# EAGLE board MJ838 - rev.1c (EAGLE 9.6.2)
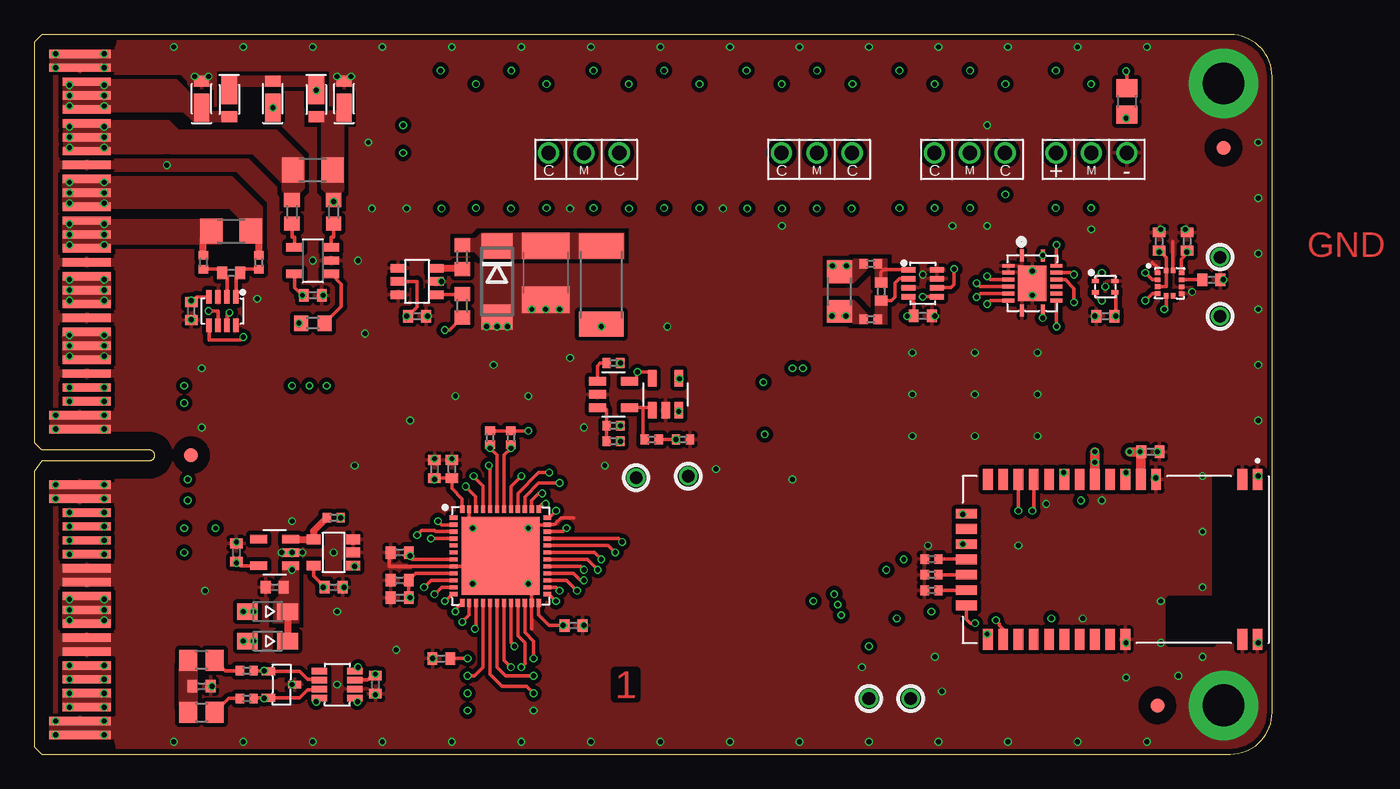
[diagram p23: board, top side]
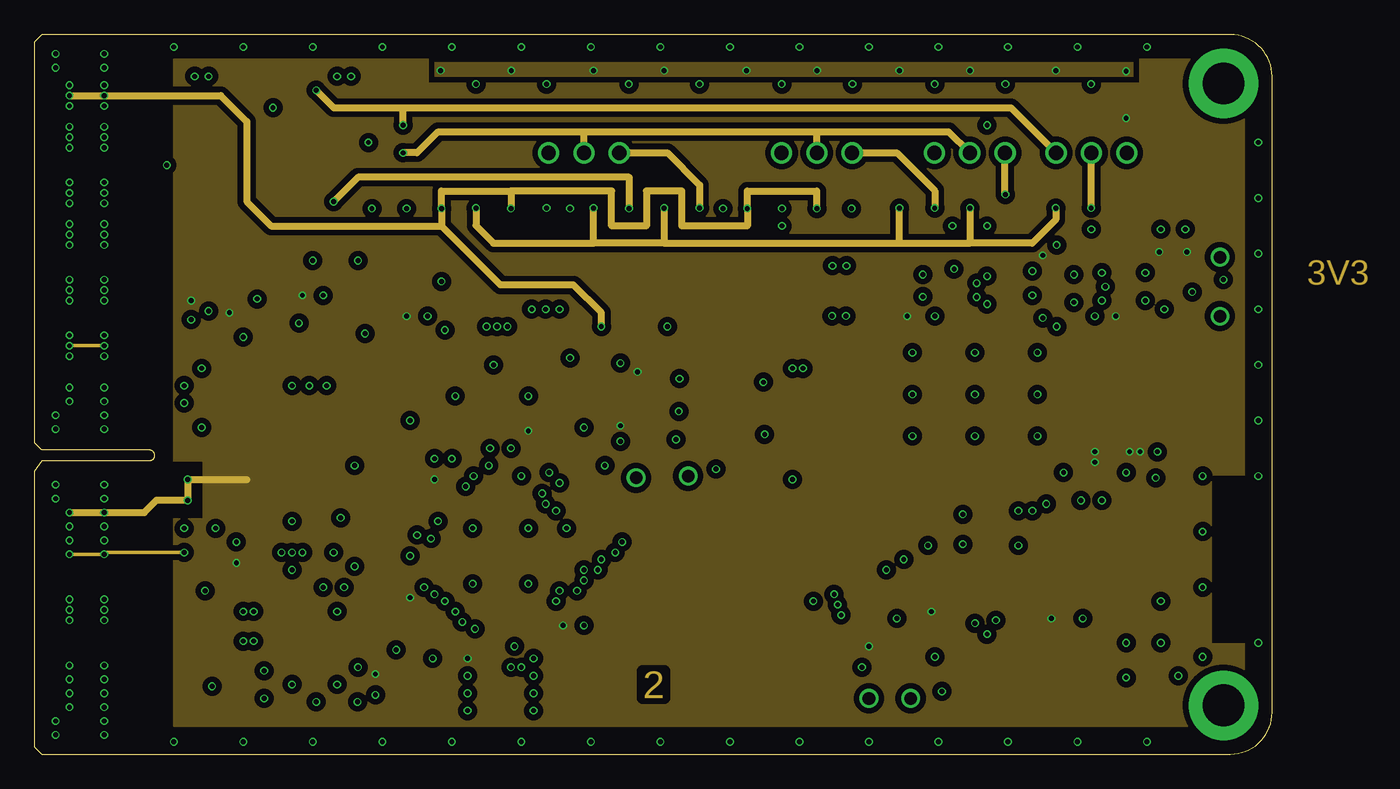
[diagram p24: board, inner layer Route2]
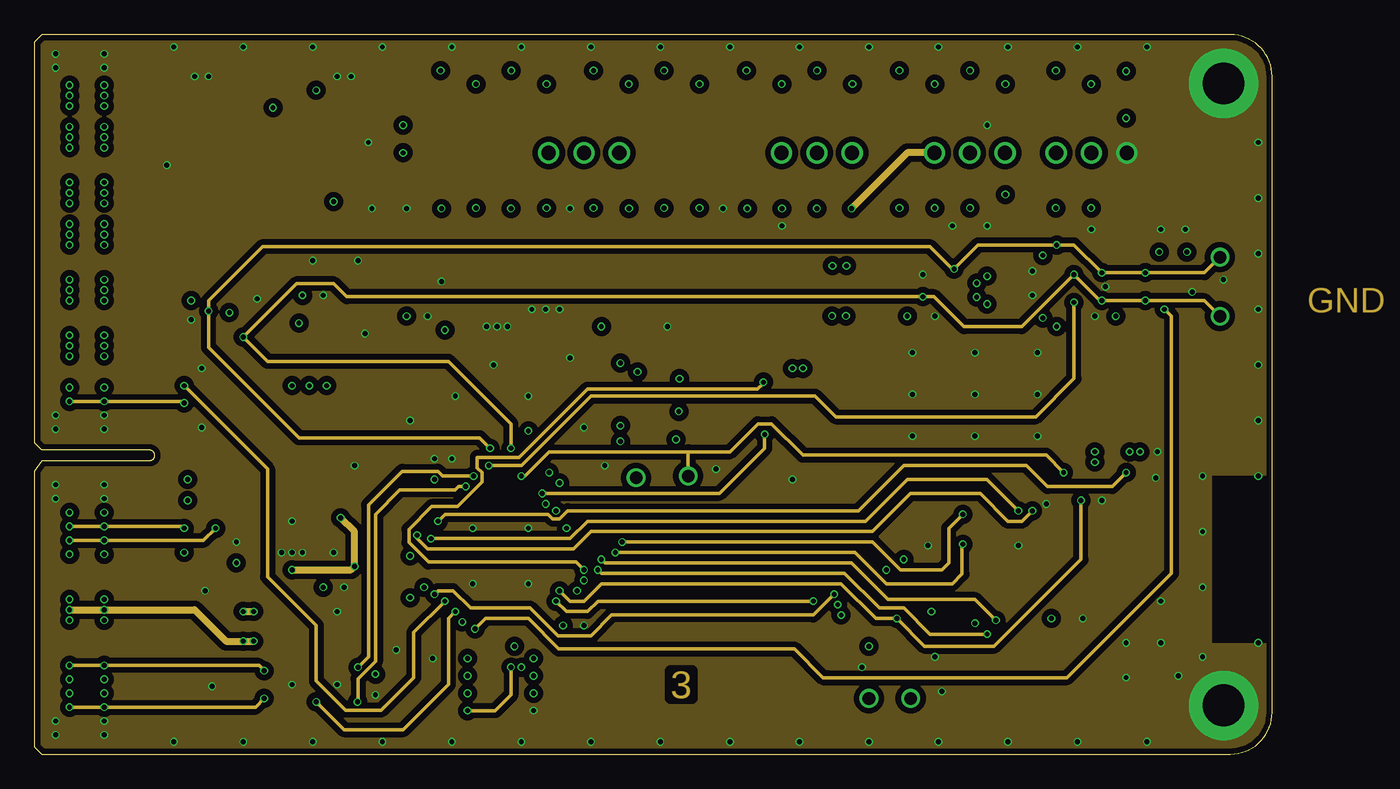
[diagram p25: board, inner layer Route3]
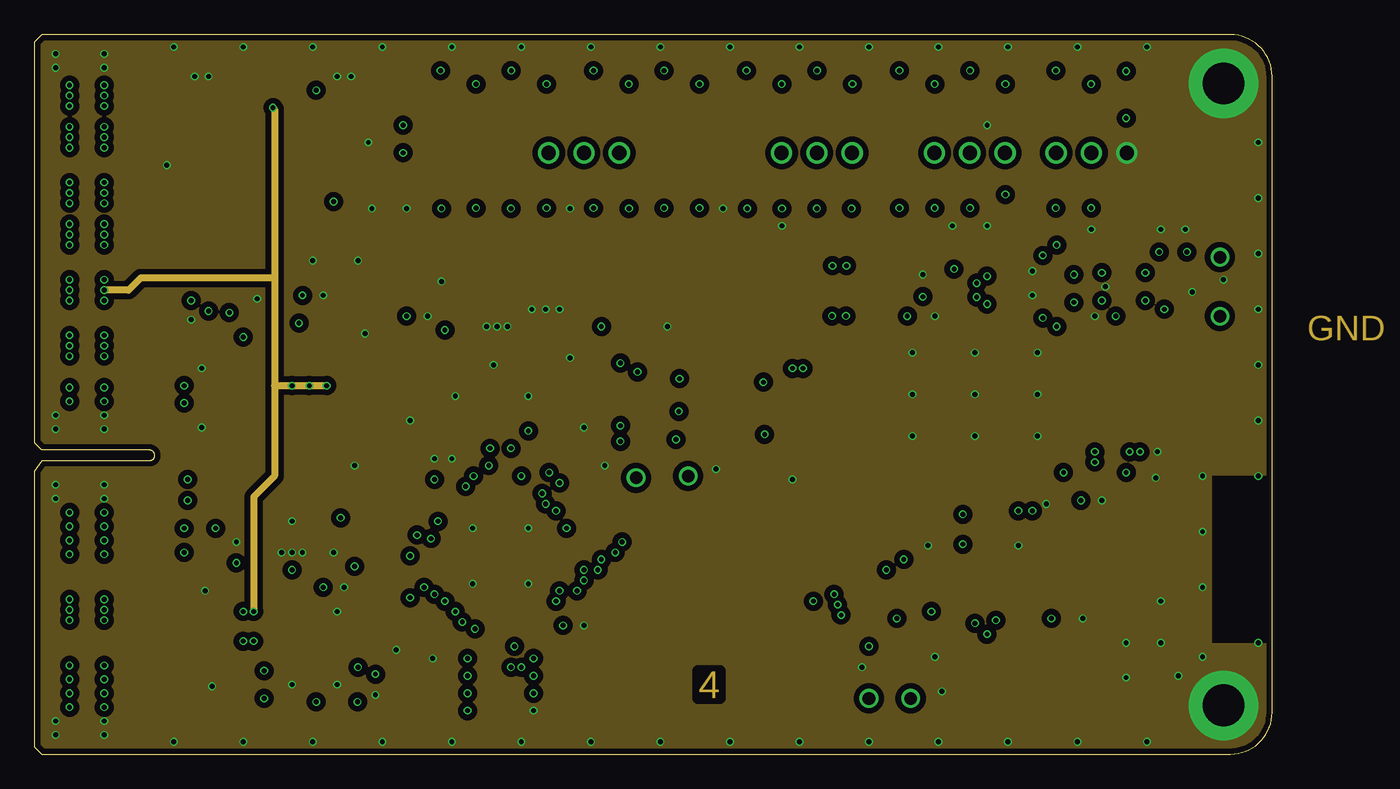
[diagram p26: board, inner layer Route14]
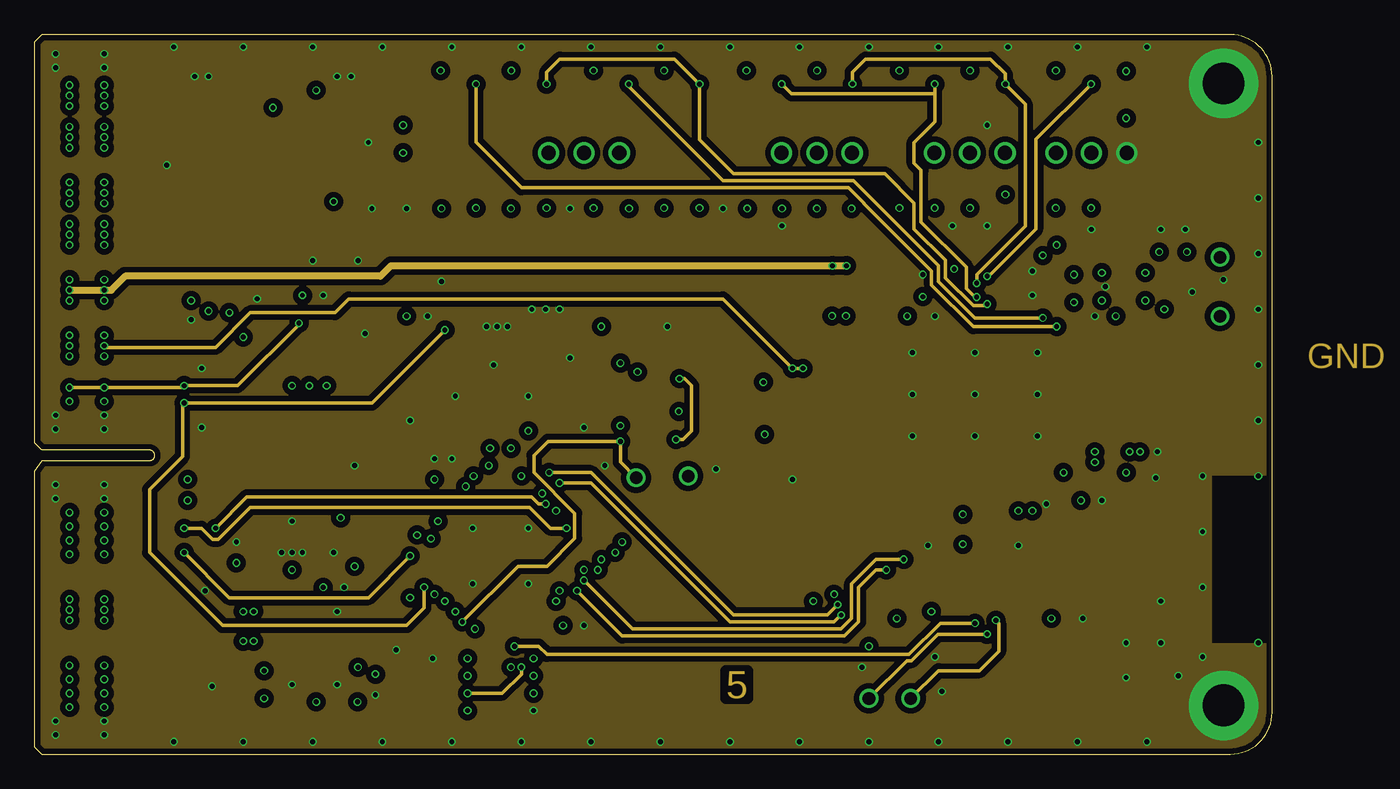
[diagram p27: board, inner layer Route15]
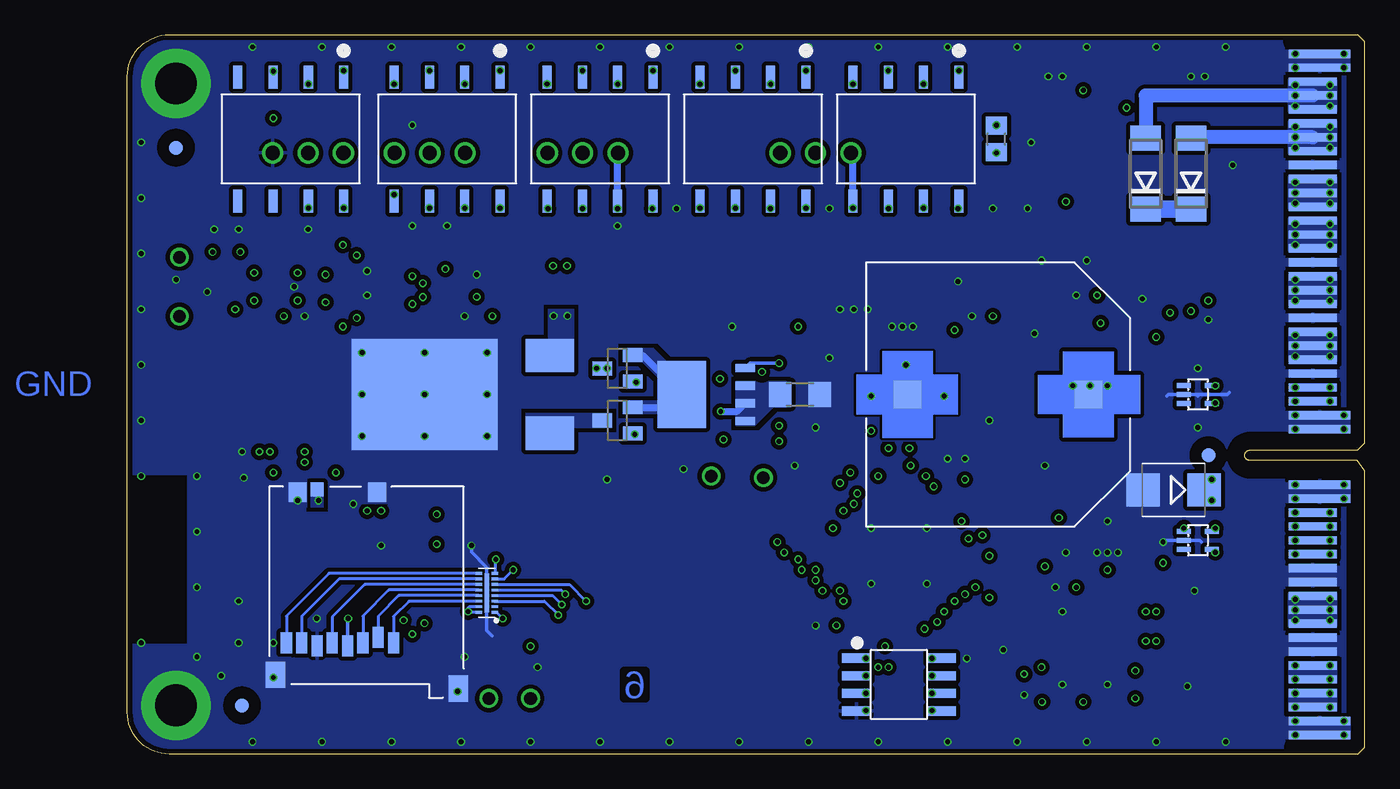
[diagram p28: board, bottom side, seen from below]

Size 89 x 51.75 mm. Coordinates in mm from the lower left corner, seen from the top.
Outline: 0.5,0 0,0.5 0,20.38 0.55,21.12 8.3,21.12 arc90 8.62,21.48 arc90 8.25,21.88 0.5,21.88 0,22.38 0,51.25 0.5,51.75 86,51.75 arc-90 89,48.75 89,3 arc-90 86,0 0.5,0
Copper layers (1*2*3*14*15*16): Top 0.0432mm / dielectric 0.1107mm / Route2 0.0175mm / dielectric 4mil / Route3 0.0175mm / dielectric 0.925575mm / Route14 0.0175mm / dielectric 4mil / Route15 0.0175mm / dielectric 0.1107mm / Bottom 0.0432mm
Design rules "oshpark-6layer": minimum track width 5mil, minimum drill 8mil, track to track 5mil, track to pad 5mil, pad to pad 5mil, via to via 5mil, smd to smd 5mil, copper to edge 15mil, drill to drill 6mil, minimum pad ring 4mil, minimum via ring 4mil, stop-mask expansion 1.5mil, vias tented up to drill 0mil, thermal gap 10mil
Net classes: 0 GND: width 0.25 mm, drill 0.35 mm, clearance 0.19 mm; 1 BAT+: width 0.5 mm, drill 0.35 mm, clearance 0.5 mm to class 0, clearance 0.5 mm; 2 signal: width 0.25 mm, drill 0.35 mm, clearance 0.19 mm to class 0, clearance 0.19 mm to class 1, clearance 0.19 mm; 3 3V3: width 0.25 mm, drill 0.35 mm, clearance 0.19 mm to class 0, clearance 0.19 mm to class 1, clearance 0.19 mm to class 2, clearance 0.19 mm; 4 Vdc: width 0.5 mm, drill 0.35 mm, clearance 0.5 mm to class 0, clearance 0.5 mm to class 1, clearance 0.5 mm to class 2, clearance 0.5 mm to class 3, clearance 0.5 mm; 5 Vdynamo: width 0.5 mm, drill 0.35 mm, clearance 0.5 mm to class 0, clearance 0.5 mm to class 1, clearance 0.5 mm to class 2, clearance 0.5 mm to class 3, clearance 0.5 mm to class 4, clearance 0.5 mm; 6 Vac: width 0.5 mm, drill 0.35 mm, clearance 0.5 mm to class 0, clearance 0.5 mm to class 1, clearance 0.5 mm to class 2, clearance 0.5 mm to class 3, clearance 0.5 mm to class 4, clearance 0.5 mm to class 5, clearance 0.5 mm

## Footprints (pad centres in the part's own frame; a part is rotated, then mirrored left to right if it is on the bottom)
C0402 = smd 0.7 x 0.9: 1 -0.65,0; 2 0.65,0
LGA-12 = smd 0.39 x 0.33: 1_SCLK -0.863,0.755; 2_MOSI/SDA -0.863,0.255; 3_MISO/ASEL -0.863,-0.245; 4_!CS!/SCL -0.863,-0.745; 7_GND 0.858,-0.757; 8_ADC_IN 0.858,-0.258; 9_VREG_OUT 0.858,0.242; 10_VS 0.858,0.743 | smd 0.33 x 0.39: 5_INT1 -0.25,-0.912; 6_INT2 0.25,-0.912; 11_GND 0.25,0.91; 12_VDDIO -0.25,0.91
SOT-23-5 = smd 0.6 x 1.2: 1 0.95,1.15; 2 0,1.15; 3 -0.95,1.15; 4 -0.95,-1.15; 5 0.95,-1.15
SOT669 = smd 4.826 x 3.5: D 0,1.755 | smd 0.6 x 1.4: G 1.9,-2.8; S1 -1.91,-2.8; S2 -0.64,-2.8; S3 0.63,-2.8
SOT-23-8 = smd 1 x 0.4: P$1 -1.025,0.975; P$2 -1.025,0.325; P$3 -1.025,-0.325; P$4 -1.025,-0.975; P$5 1.025,-0.975; P$6 1.025,-0.325; P$7 1.025,0.325; P$8 1.025,0.975
R0402 = smd 0.6 x 0.7: 1 -0.5,0; 2 0.5,0
R1206 = smd 1.6 x 1.803: 1 -1.422,0; 2 1.422,0
SOT23 = smd 1 x 1.4: 1 -0.95,-1.1; 2 0.95,-1.1; 3 0,1.1
TO-263-2 = smd 2.4 x 3.5: 1 -2.8,1.75; 2 2.8,1.75 | smd 8 x 10.52: DIE 0,10.75
MODULE_RN4678-V/RM100 = smd 1.5 x 0.7: 1 -5.75,10.2; 2 -5.75,9.1; 3 -5.75,2.9; 4 -5.75,1.8; 5 -5.75,0.7; 6 -5.75,-0.4; 7 -5.75,-1.5; 8 -5.75,-2.6; 9 -5.75,-3.7; 10 -5.75,-4.8; 11 -5.75,-5.9; 12 -5.75,-7; 13 -5.75,-8.1; 14 -5.75,-9.2; 22 5.75,-9.2; 23 5.75,-8.1; 24 5.75,-7; 25 5.75,-5.9; 26 5.75,-4.8; 27 5.75,-3.7; 28 5.75,-2.6; 29 5.75,-1.5; 30 5.75,-0.4; 31 5.75,0.7; 32 5.75,9.1; 33 5.75,10.2 | smd 0.7 x 1.5: 15 -3.3,-10.75; 16 -2.2,-10.75; 17 -1.1,-10.75; 18 0,-10.75; 19 1.1,-10.75; 20 2.2,-10.75; 21 3.3,-10.75
SOT23-8 = smd 0.45 x 1.1: P$1 -0.975,-1.275; P$2 -0.325,-1.275; P$3 0.325,-1.275; P$4 0.975,-1.275; P$5 0.975,1.275; P$6 0.325,1.275; P$7 -0.325,1.275; P$8 -0.975,1.275
SOT-23-3 = smd 0.56 x 0.95: 1 -0.95,-0.95; 2 0.95,-0.95; 3 0,0.95
R0805 = smd 1.3 x 1.5: 1 -0.95,0; 2 0.95,0
SMD = smd 4.45 x 0.6: 1 0,24.5; 3 0,23.5; 35 0,7.5; 37 0,6.5; 45 0,2.5; 47 0,1.5; 97 0,-23.5; 99 0,-24.5 | smd 4.45 x 0.6 bottom: 2 0,24.5; 4 0,23.5; 36 0,7.5; 38 0,6.5; 46 0,2.5; 48 0,1.5; 98 0,-23.5; 100 0,-24.5 | smd 3.45 x 0.6: 5 0.5,22.5; 7 0.5,21.5; 9 0.5,20.5; 11 0.5,19.5; 13 0.5,18.5; 15 0.5,17.5; 17 0.5,16.5; 19 0.5,15.5; 21 0.5,14.5; 23 0.5,13.5; 25 0.5,12.5; 27 0.5,11.5; 29 0.5,10.5; 31 0.5,9.5; 33 0.5,8.5; 49 0.5,0.5; 51 0.5,-0.5; 53 0.5,-1.5; 55 0.5,-2.5; 57 0.5,-3.5; 59 0.5,-4.5; 61 0.5,-5.5; 63 0.5,-6.5; 65 0.5,-7.5; 67 0.5,-8.5; 69 0.5,-9.5; 71 0.5,-10.5; 73 0.5,-11.5; 75 0.5,-12.5; 77 0.5,-13.5; 79 0.5,-14.5; 81 0.5,-15.5; 83 0.5,-16.5; 85 0.5,-17.5; 87 0.5,-18.5; 89 0.5,-19.5; 91 0.5,-20.5; 93 0.5,-21.5; 95 0.5,-22.5 | smd 3.45 x 0.6 bottom: 6 0.5,22.5; 8 0.5,21.5; 10 0.5,20.5; 12 0.5,19.5; 14 0.5,18.5; 16 0.5,17.5; 18 0.5,16.5; 20 0.5,15.5; 22 0.5,14.5; 24 0.5,13.5; 26 0.5,12.5; 28 0.5,11.5; 30 0.5,10.5; 32 0.5,9.5; 34 0.5,8.5; 50 0.5,0.5; 52 0.5,-0.5; 54 0.5,-1.5; 56 0.5,-2.5; 58 0.5,-3.5; 60 0.5,-4.5; 62 0.5,-5.5; 64 0.5,-6.5; 66 0.5,-7.5; 68 0.5,-8.5; 70 0.5,-9.5; 72 0.5,-10.5; 74 0.5,-11.5; 76 0.5,-12.5; 78 0.5,-13.5; 80 0.5,-14.5; 82 0.5,-15.5; 84 0.5,-16.5; 86 0.5,-17.5; 88 0.5,-18.5; 90 0.5,-19.5; 92 0.5,-20.5; 94 0.5,-21.5; 96 0.5,-22.5
SMB = smd 2.4 x 2.4: A 2.2,0; C -2.2,0
FIDUCIAL_1MM = smd 1 x 1: 1 0,0
SMD' = smd 0.5 x 0.3: SCL -0.7,-0.4; SDA -0.7,0.4; VDD 0.7,-0.4; VSS 0.7,0.4
SOT323-5 = smd 1 x 0.35: GND -1,0; I1 -1,0.65; I2 -1,-0.65; I3 1,-0.65; I4 1,0.65
SOIC08 = smd 2.032 x 0.66: 1 -3.073,1.905; 2 -3.073,0.635; 3 -3.073,-0.635; 4 -3.073,-1.905; 5 3.073,-1.905; 6 3.073,-0.635; 7 3.073,0.635; 8 3.073,1.905
SOT23-5 = smd 0.7 x 1: 1_VDD -0.95,-1.4; 2_GND 0,-1.4; 3_GND 0.95,-1.4; 4_DOUT 0.95,1.45; 5_CD -0.95,1.45
SOT-23-5L = smd 0.6 x 1.2: ADJ/NC -0.95,-1.15; EN -0.95,1.15; GND 0,1.15; IN 0.95,1.15; OUT 0.95,-1.15
SOD323-W = smd 1.5 x 1.2: A 1.45,0; C -1.45,0
DO214AA = smd 1.8 x 2.2: A 2.55,0; C -2.55,0
US2H = smd 2 x 1.1: A -1,0 | smd 0.8 x 1.1: C 0.9,0
TH-2S = drill 1.016: 1_POS -2.54,0; 2_MID 0,0; 3_NEG 2.54,0
SMD_DIP8 = smd 0.65 x 1.65: 1_ANODE1 -3.81,-4.44; 2_CATHODE1 -1.27,-4.44; 3_ANODE2 1.27,-4.44; 4_CATHODE2 3.81,-4.44; 5_DRAIN2-1 3.81,4.48; 6_DRAIN2-2 1.27,4.48; 7_DRAIN1-1 -1.27,4.48; 8_DRAIN1-2 -3.81,4.48
VQFN16 = smd 0.85 x 0.28: 1 -1.975,-0.75; 8 1.975,-0.75; 9 1.975,0.75; 16 -1.975,0.75 | smd 0.28 x 0.85: 2 -1.25,-1.725; 3 -0.75,-1.725; 4 -0.25,-1.725; 5 0.25,-1.725; 6 0.75,-1.725; 7 1.25,-1.725; 10 1.25,1.725; 11 0.75,1.725; 12 0.25,1.725; 13 -0.25,1.725; 14 -0.75,1.725; 15 -1.25,1.725 | smd 2.55 x 2.05: 17 0,0
TH-2S-BACK-TO-BACK = drill 1.016: 1_C -2.54,0; 2_MID 0,0; 3_C 2.54,0
SOT23-5' = smd 0.6 x 1.2: 1 -0.95,-1.306; 2 0,-1.306; 3 0.95,-1.306; 4 0.95,1.306; 5 -0.95,1.306
R0603 = smd 1 x 1.1: 1 -0.85,0; 2 0.85,0
CAP_EEEFK1E472SV = smd 2 x 2: + -6.5,0; - 6.5,0
C1812 = smd 1.9 x 3.4: 1 -1.95,0; 2 1.95,0
SOT-23 = smd 1.1 x 0.6: P$1 -1.35,0.95; P$2 -1.35,0; P$3 -1.35,-0.95; P$4 1.35,-0.95; P$5 1.35,0; P$6 1.35,0.95
R2512 = smd 1.8 x 3.2: 1 -2.8,0; 2 2.8,0
SMD'' = smd 0.95 x 1: CARD_DETECT -3.56,7.4 | smd 0.8 x 1.5: CD/DATA3 0.84,-3.26; CLK -2.46,-3.66; CMD -0.26,-3.66; DATA0 -4.66,-3.66; DATA1 -5.76,-3.66; DATA2 1.94,-3.66; GND -3.56,-3.86; VDD -1.36,-3.86 | smd 1.3 x 1.4: S1 -4.95,7.2; S2 0.75,7.2 | smd 1.4 x 1.9: S3 -6.55,-5.95; S4 6.6,-6.95
MICRO_QFN = smd 0.2 x 0.45: 1 -1.4,-0.375; 2 -1,-0.375; 3 -0.6,-0.375; 4 -0.2,-0.375; 5 0.2,-0.375; 6 0.6,-0.375; 7 1,-0.375; 8 1.4,-0.375; 9 1.4,0.775; 10 1,0.775; 11 0.6,0.775; 12 0.2,0.775; 13 -0.2,0.775; 14 -0.6,0.775; 15 -1,0.775; 16 -1.4,0.775 | smd 2.8 x 0.3: 17 0,0.2
UFQFPN48 = smd 0.55 x 0.3: P$1 -3.375,2.75; P$2 -3.375,2.25; P$3 -3.375,1.75; P$4 -3.375,1.25; P$5 -3.375,0.75; P$6 -3.375,0.25; P$7 -3.375,-0.25; P$8 -3.375,-0.75; P$9 -3.375,-1.25; P$10 -3.375,-1.75; P$11 -3.375,-2.25; P$12 -3.375,-2.75; P$25 3.375,-2.75; P$26 3.375,-2.25; P$27 3.375,-1.75; P$28 3.375,-1.25; P$29 3.375,-0.75; P$30 3.375,-0.25; P$31 3.375,0.25; P$32 3.375,0.75; P$33 3.375,1.25; P$34 3.375,1.75; P$35 3.375,2.25; P$36 3.375,2.75 | smd 0.3 x 0.55: P$13 -2.75,-3.375; P$14 -2.25,-3.375; P$15 -1.75,-3.375; P$16 -1.25,-3.375; P$17 -0.75,-3.375; P$18 -0.25,-3.375; P$19 0.25,-3.375; P$20 0.75,-3.375; P$21 1.25,-3.375; P$22 1.75,-3.375; P$23 2.25,-3.375; P$24 2.75,-3.375; P$37 2.75,3.375; P$38 2.25,3.375; P$39 1.75,3.375; P$40 1.25,3.375; P$41 0.75,3.375; P$42 0.25,3.375; P$43 -0.25,3.375; P$44 -0.75,3.375; P$45 -1.25,3.375; P$46 -1.75,3.375; P$47 -2.25,3.375; P$48 -2.75,3.375 | smd 5.6 x 5.6: PAD 0,0
TH-0.9 = drill 0.9: P$1 0,0

## Placement (x,y rotation side)
ACCELEROMETER:C1  0.1uF / 10V  [C0402]  80.88,36.88 270 top
ACCELEROMETER:C2  0.2uF / 10V  [C0402]  84.62,34.12 180 top
ACCELEROMETER:C4  0.11uF / 10V  [C0402]  82.88,36.88 270 top
ACCELEROMETER:IC1  ADXL367BCCZ-RL7  [LGA-12]  81.62,33.88 0 top
ADJUSTABLE_LOAD:IC2  AD8515ARTZ-REEL7  [SOT-23-5]  41.62,25.88 90 top
ADJUSTABLE_LOAD:IC3  PH2925U,115  [SOT669]  47.38,25.88 90 bottom
ADJUSTABLE_LOAD:IC4  AD8515ARTZ-REEL7  [SOT-23-5]  45.38,25.88 180 top
ADJUSTABLE_LOAD:INA219:C1  0.1uF / 10V  [C0402]  63.88,31.52 0 top
ADJUSTABLE_LOAD:INA219:C2  ???  [C0402]  60.88,33.27 270 top
ADJUSTABLE_LOAD:INA219:IC3  INA219BIDCNT  [SOT-23-8]  63.88,33.87 0 top
ADJUSTABLE_LOAD:INA219:R3  ???  [R0402]  60.12,31.27 180 top
ADJUSTABLE_LOAD:INA219:R4  0.1R / 0.5W - LVK12R100CER  [R1206]  57.88,33.27 270 top
ADJUSTABLE_LOAD:INA219:R5  ???  [R0402]  60.12,35.27 180 top
ADJUSTABLE_LOAD:Q2  BSS123  [SOT23]  53.75,24 90 bottom
ADJUSTABLE_LOAD:Q3  BSS123  [SOT23]  53.75,27.75 90 bottom
ADJUSTABLE_LOAD:R1  3k  [R0402]  46.62,22.62 180 top
ADJUSTABLE_LOAD:R2  0.1R / 0.5W - LVK12R100CER  [R1206]  40.62,25.88 180 bottom
ADJUSTABLE_LOAD:R3  1k  [R0402]  41.62,28.12 0 top
ADJUSTABLE_LOAD:R4  27k  [R0402]  44.38,22.62 180 top
ADJUSTABLE_LOAD:R5  12R, 20W, AP725 12R F  [TO-263-2]  56.88,25.88 90 bottom
ADJUSTABLE_LOAD:R6  100k  [R0402]  41.62,23.62 0 top
ADJUSTABLE_LOAD:R7  10k  [R0402]  41.62,22.5 180 top
BLUETOOTH:C1  10uF / 10V  [C0402]  80.25,21.75 180 top
BLUETOOTH:IC1  RN4678-V/RM113  [MODULE_RN4678-V/RM100]  77.75,14 270 top
BLUETOOTH:R1  0R  [R0402]  64.5,14.03 180 top
BLUETOOTH:R2  0R  [R0402]  64.5,12.9 180 top
BLUETOOTH:R3  0R  [R0402]  64.5,11.78 180 top
CAN_INFRA:C1  47nF / 10V  [C0402]  12,4.88 0 top
CAN_INFRA:C5  0.1uF / 10V  [C0402]  24.5,5 270 top
CAN_INFRA:IC1  TCAN334GDCNT  [SOT23-8]  21.75,5 90 top
CAN_INFRA:IC2  SZNUP2105LT1G  [SOT-23-3]  17.75,5 270 top
CAN_INFRA:R1  60R, 0.5W  [R0805]  12,6.75 180 top
CAN_INFRA:R2  60R, 0.5W  [R0805]  12,3 0 top
CAN_INFRA:R3  0  [R0402]  15.25,4 0 top
CAN_INFRA:R4  0  [R0402]  15.25,6 0 top
CONN1  MEC1-150-02-F-D-RA1-SL  [SMD]  3.25,25.88 180 bottom
D1  SMLVT3V3  [SMB]  13.75,19 180 bottom
FID1  n/a  [FIDUCIAL_1MM]  80.75,3.5 0 bottom
FID2  n/a  [FIDUCIAL_1MM]  11.25,21.5 180 top
FID3  n/a  [FIDUCIAL_1MM]  11.25,21.5 0 bottom
FID4  n/a  [FIDUCIAL_1MM]  80.75,3.5 180 top
FID5  n/a  [FIDUCIAL_1MM]  85.5,43.62 0 bottom
FID6  n/a  [FIDUCIAL_1MM]  85.5,43.62 180 top
HUMIDITY_SENSOR:C5  0.1uF / 10V  [C0402]  77,31.5 180 top
HUMIDITY_SENSOR:IC1  SHT40-AD1F-R2  [SMD']  77,33.62 0 top
IC1  ESDALC6V1W5  [SOT323-5]  12,25.88 0 bottom
IC2  ESDALC6V1W5  [SOT323-5]  12,15.38 0 bottom
INA1:C1  0.1uF / 10V  [C0402]  11.26,31.87 270 top
INA1:C2  ???  [C0402]  14.12,34.62 180 top
INA1:IC3  INA219BIDCNT  [SOT-23-8]  13.51,31.87 270 top
INA1:R3  ???  [R0402]  12.12,35.38 90 top
INA1:R4  0.1R / 0.5W - LVK12R100CER  [R1206]  14.12,37.62 180 top
INA1:R5  ???  [R0402]  16.12,35.38 90 top
M-RAM:C2  0.1uF / 10V  [C0402]  29.25,6.88 0 top
M-RAM:IC1  S3A3204V0M-AI1AT  [SOIC08]  33.5,5 0 bottom
MARKER1  6 layer  [6L]  41.5,5 0 top
RECTIFIER:3V3:C1  1uF / 10V  [C0402]  21.5,12 0 top
RECTIFIER:3V3:C2  1uF / 10V  [C0402]  17.25,12 180 top
RECTIFIER:3V3:C7  1uF / 10V  [C0402]  14.5,14.5 270 top
RECTIFIER:3V3:IC1  R3119N058A  [SOT23-5]  21.5,14.5 90 top
RECTIFIER:3V3:IC2  LDK320AM33R  [SOT-23-5L]  17.25,14.5 270 top
RECTIFIER:3V3:R1  100k / 0.1W  [R0402]  21.5,17 180 top
RECTIFIER:D1  BAT 60A E6327  [SOD323-W]  16.75,8.12 180 top
RECTIFIER:D2  BAT 60A E6327  [SOD323-W]  16.75,10.25 180 top
RECTIFIER:DYNAMO_OVP:D3  19V/5W  [DO214AA]  12.5,41.75 90 bottom
RECTIFIER:DYNAMO_OVP:D4  19V/5W  [DO214AA]  15.75,41.75 90 bottom
RECTIFIER:GRAETZ+DELON:D1  CUHS20S30,H3F  [US2H]  14,46.75 270 top
RECTIFIER:GRAETZ+DELON:D2  CUHS20S30,H3F  [US2H]  12,47.5 90 top
RECTIFIER:GRAETZ+DELON:D3  CUHS20S30,H3F  [US2H]  20.25,46.75 270 top
RECTIFIER:GRAETZ+DELON:D4  CUHS20S30,H3F  [US2H]  22.25,47.5 90 top
RECTIFIER:GRAETZ+DELON:DELON:C1  330μF / 35V / ultralow ESR  [TH-2S]  76,43.25 0 top
RECTIFIER:GRAETZ+DELON:DELON:SSR_NO/NO3:IC1  LAA710S  [SMD_DIP8]  77.25,44.25 180 bottom
RECTIFIER:GRAETZ+DELON:IC1  TLC59208FIRGYR  [VQFN16]  71.75,33.88 270 top
RECTIFIER:GRAETZ+DELON:R1  625  [R0805]  78.55,46.95 270 top
RECTIFIER:GRAETZ+DELON:TUNING_CAPS:C2  1500μF / 35V / ultralow ESR  [TH-2S-BACK-TO-BACK]  39.5,43.25 0 top
RECTIFIER:GRAETZ+DELON:TUNING_CAPS:C3  1500μF / 35V / ultralow ESR  [TH-2S-BACK-TO-BACK]  56.25,43.25 0 top
RECTIFIER:GRAETZ+DELON:TUNING_CAPS:C4  1500μF / 35V / ultralow ESR  [TH-2S-BACK-TO-BACK]  67.25,43.25 0 top
RECTIFIER:GRAETZ+DELON:TUNING_CAPS:R2  47k  [R0805]  26.5,44.25 90 bottom
RECTIFIER:GRAETZ+DELON:TUNING_CAPS:SSR_NO/NO1:IC1  LAA710S  [SMD_DIP8]  55,44.25 180 bottom
RECTIFIER:GRAETZ+DELON:TUNING_CAPS:SSR_NO/NO2:IC1  LAA710S  [SMD_DIP8]  66,44.25 180 bottom
RECTIFIER:GRAETZ+DELON:TUNING_CAPS:SSR_NO/NO3:IC1  LAA710S  [SMD_DIP8]  33,44.25 180 bottom
RECTIFIER:GRAETZ+DELON:TUNING_CAPS:SSR_NO/NO4:IC1  LAA710S  [SMD_DIP8]  44,44.25 180 bottom
RECTIFIER:PHASE_SHIFT:C1  0.1uF / 10V  [C0402]  20,33 180 top
RECTIFIER:PHASE_SHIFT:IC1  LT1716CS5#TRMPBF  [SOT23-5']  20,35.5 90 top
RECTIFIER:PHASE_SHIFT:R1  0R  [R0603]  20,31 180 top
RECTIFIER:PHASE_SHIFT:R2  0R  [R0603]  21.5,39 270 top
RECTIFIER:PHASE_SHIFT:R3  0R  [R0603]  18.5,39 270 top
RECTIFIER:PHASE_SHIFT:R4  0.01R / 0.5W / 0.25%  [R1206]  20,42 0 top
RECTIFIER:SMOOTHING_CAP:C1  EEE-FK1E472SV  [CAP_EEEFK1E472SV]  26.38,25.88 180 bottom
RECTIFIER:SMOOTHING_CAP:D8  CUHS20S30,H3F  [US2H]  17.12,47.5 90 top
RECTIFIER:ZERO-CROSS_DETECTOR:C3  0.1uF / 10V  [C0402]  27.5,31.5 180 top
RECTIFIER:ZERO-CROSS_DETECTOR:C8  10nF / 100v  [C1812]  36.75,34.62 90 top
RECTIFIER:ZERO-CROSS_DETECTOR:D1  6V/3W  [DO214AA]  33.25,34 270 top
RECTIFIER:ZERO-CROSS_DETECTOR:IC1  TLV6703DDCR  [SOT-23]  27.5,34 180 top
RECTIFIER:ZERO-CROSS_DETECTOR:R1  10k/3W  [R2512]  40.75,33.75 90 top
RECTIFIER:ZERO-CROSS_DETECTOR:R2  0R  [R0603]  30.75,35.75 270 top
RECTIFIER:ZERO-CROSS_DETECTOR:R3  0R  [R0603]  30.75,32.25 270 top
SD_CARD:IC1  0473521001  [SMD'']  71.8,11.65 0 bottom
SD_CARD:IC3  EMIF06-MSD02N16  [MICRO_QFN]  62.95,11.6 90 bottom
STM32L4:C1  0.1uF / 10V  [C0402]  38.75,9.25 180 top
STM32L4:C2  0.1uF / 10V  [C0402]  28.75,20.5 270 top
STM32L4:C3  4.7uF / 10V  [C0402]  30,20.5 270 top
STM32L4:C4  0.1uF / 10V  [C0402]  26.25,14.5 0 top
STM32L4:C6  1uF / 10V  [C0402]  26.25,11.25 0 top
STM32L4:C8  0.1uF / 10V  [C0402]  26.25,12.5 0 top
STM32L4:IC1  STM32L4P5CGU6  [UFQFPN48]  33.5,14.25 0 top
STM32L4:R1  1k  [R0402]  32.75,22.75 90 top
STM32L4:R2  1k  [R0402]  34.25,22.75 90 top
TP1  CAN high  [TH-0.9]  85.25,31.5 0 top
TP2  CAN high  [TH-0.9]  85.25,35.75 0 top
TP3  CAN high  [TH-0.9]  63,4 0 top
TP4  CAN high  [TH-0.9]  60,4 0 top
TP5  CAN high  [TH-0.9]  47,20 0 top
TP6  CAN high  [TH-0.9]  43.25,19.88 0 top

## Tracks (layer width: path | path; a pad name or v marks a point on that pad's centre or on a via)
3V3  (via drill 0.35)
  Top 0.25: CAN_INFRA:IC1.P$3 23.93,5.33 24.25,5.65 CAN_INFRA:C5.1 v24.5,5.75 | INA1:IC3.P$4 11.63,32.9 INA1:C1.1 v11.26,32.62 | RECTIFIER:PHASE_SHIFT:IC1.5 18.69,33.56 v19.25,33 RECTIFIER:PHASE_SHIFT:C1.2 | v26.75,31.5 RECTIFIER:ZERO-CROSS_DETECTOR:C3.2 27.5,32.15 27.5,34 RECTIFIER:ZERO-CROSS_DETECTOR:IC1.P$5 | ACCELEROMETER:IC1.10_VS 82.48,35.62 82.98,36.12 ACCELEROMETER:C4.2 v82.88,36.12 | ACCELEROMETER:IC1.3_MISO/ASEL 81.38,33.62 ACCELEROMETER:IC1.12_VDDIO 81.38,35.73 ACCELEROMETER:C1.2 v80.88,36.12 | v62.75,31.5 62.77,31.52 ADJUSTABLE_LOAD:INA219:C1.1 63.23,32.52 ADJUSTABLE_LOAD:INA219:IC3.P$4 | RECTIFIER:GRAETZ+DELON:IC1.16 v72.5,35.88 | BLUETOOTH:C1.2 79.55,21.75 v79.5,21.75 | INA1:IC3.P$7 13.83,31.58 v14,31.75 | STM32L4:IC1.P$48 30.75,18.35 30,19.1 STM32L4:C3.2 STM32L4:C2.2 v28.75,19.75 | STM32L4:R1.2 STM32L4:R2.2 v35.5,23.25 | STM32L4:C1.2 v38,9.25 37,9.25 36.25,10 STM32L4:IC1.P$24 | HUMIDITY_SENSOR:C5.1 v77.75,31.5 77.75,33.17 HUMIDITY_SENSOR:IC1.VDD | RECTIFIER:3V3:IC2.OUT 14.8,13.55 RECTIFIER:3V3:C7.2 v14.5,13.75 | STM32L4:IC1.P$9 27.4,13 STM32L4:C8.2 STM32L4:C6.2 v27,11.25 | ADJUSTABLE_LOAD:IC4.5 44.42,27.5 v43.35,27.5 43.27,27.5 43.27,26.75 42.85,26.75 ADJUSTABLE_LOAD:IC2.5 | M-RAM:C2.2 v31.12,6.88 | v78.5,45.75 78.55,45.8 RECTIFIER:GRAETZ+DELON:R1.2
  Top 0.7: BLUETOOTH:IC1.4 79.55,21.75 79.5,21.8 v79.5,21.75 v78.75,21.75 | BLUETOOTH:IC1.7 v76.25,21.75
  Route2 0.5: v2.5,17.38 v5,17.38 7.88,17.38 8.75,18.25 v11,18.25 v11,19.75 15.25,19.75
  Bottom 0.2: SD_CARD:IC3.15 64.4,10.6 64.5,10.5 v64.5,10.25 64.45,10.2 SD_CARD:IC3.16
  Bottom 0.25: SD_CARD:IC1.VDD 73.16,9.71 v73.12,9.75 | D1.C 11,19.55 v11,19.75 | M-RAM:IC1.8 31.09,6.91 v31.12,6.88
  other vias: 60,7.75 42.12,23.62 76.25,21
  pour Route2 (isolate 0.406, rank 6, no thermals): 10,2 87,2 87,50 10,50
  pour Top: 2.12,17.62 5.38,17.62 5.38,17.12 2.12,17.12
  pour Bottom: 2.12,17.62 5.38,17.62 5.38,17.12 2.12,17.12
  cutout Route2: 10,21 12,21 12,17 10,17
!LED_RST!  (via drill 0.35)
  Top 0.25: RECTIFIER:GRAETZ+DELON:IC1.13 74.12,34.12 74.75,33.5 v74.75,32.5 | v32.66,20.75 32.75,20.66 STM32L4:IC1.P$44
  Route3 0.25: v32.66,20.75 35,20.75 40,25.75 56.12,25.75 57.62,24.25 72,24.25 74.75,27 v74.75,32.5
!QSPI_CS!  (via drill 0.35)
  Top 0.25: STM32L4:IC1.P$22 35.25,8.75 35.88,8.12 v35.88,6.88
  Bottom 0.25: M-RAM:IC1.1 35.91,6.91 v35.88,6.88
!RN4678_SWBTN!  (via drill 0.35)
  Top 0.25: STM32L4:IC1.P$2 29.25,16.5 v29,16.75 | BLUETOOTH:IC1.5 78.45,20.2 v78.5,20.25
  Route3 0.25: v29,16.75 29.5,17.25 36.91,17.25 37.26,16.91 37.74,16.91 38.34,17.5 59.25,17.5 62.5,20.75 71.34,20.75 72.84,19.25 77.5,19.25 v78.5,20.25
!STBY!  (via drill 0.35)
  Top 0.25: CAN_INFRA:IC1.P$8 20.25,3.8 v20.25,3.75 | STM32L4:IC1.P$13 30.25,10.38 v30.25,10.25
  Route3 0.25: v20.25,3.75 22.25,1.75 26.5,1.75 29.75,5 29.75,9.75 v30.25,10.25
ACCELEROMETER:VREG
  Top 0.25: ACCELEROMETER:IC1.9_VREG_OUT ACCELEROMETER:C2.2
ADJL  (via drill 0.35)
  Top 0.25: v36.5,18.75 36.25,18.75 35.75,18.25 STM32L4:IC1.P$38
  Route3 0.25: v36.5,18.75 49.25,18.75 52.5,22 v52.5,23
  Bottom 0.25: ADJUSTABLE_LOAD:Q2.1 52.55,23.05 v52.5,23
ADJUSTABLE_LOAD:DRAIN
  Bottom 0.5: ADJUSTABLE_LOAD:Q3.2 51.95,28.7 ADJUSTABLE_LOAD:IC3.D 50.05,24.95 ADJUSTABLE_LOAD:Q2.2
  pour Bottom (no thermals): 53.35,28.2 53.35,29.2 51.2,29.2 49,27 49,26.25 50,26.25 51.95,28.2
  pour Bottom (no thermals): 53.35,24.45 53.35,25.45 50.5,25.45 50.5,24.45
ADJUSTABLE_LOAD:GATE_COMMON  (via drill 0.35)
  Bottom 0.25: ADJUSTABLE_LOAD:R3.2 44.23,28.12 ADJUSTABLE_LOAD:IC3.G
  other vias: 42.12,28.12
ADJUSTABLE_LOAD:GATE_COMMON-DRIVER_OUT
  Top 0.25: ADJUSTABLE_LOAD:R3.1 40.67,28.12 40.48,27.93 ADJUSTABLE_LOAD:IC2.1
ADJUSTABLE_LOAD:IN+
  Top 0.25: ADJUSTABLE_LOAD:R7.2 ADJUSTABLE_LOAD:R6.1 41.12,24.77 40.98,24.93 ADJUSTABLE_LOAD:IC2.3
ADJUSTABLE_LOAD:IN-  (via drill 0.35)
  Top 0.5: v57.35,31.52 57.54,31.52 ADJUSTABLE_LOAD:INA219:R4.2
  other vias: 58.35,31.52
  pour Top (no thermals): 57.01,31.04 57.01,32.64 58.91,32.64 59.93,31.62 59.93,30.92 58.91,30.92 58.78,31.04
  pour Bottom (no thermals): 56.88,32 58.75,32 58.75,29.75 56.88,29.75
ADJUSTABLE_LOAD:INA219:IN+L
  Top 0.25: ADJUSTABLE_LOAD:INA219:IC3.P$1 61.05,34.85 60.88,34.67 ADJUSTABLE_LOAD:INA219:C2.1
  pour Top (no thermals): 60.43,34.02 61.33,34.02 61.33,35.62 60.43,35.62
ADJUSTABLE_LOAD:INA219:IN-H
  Top 0.25: ADJUSTABLE_LOAD:INA219:IC3.P$2 62.2,34.2 61.88,33.88 61.88,32.88 61.62,32.62 ADJUSTABLE_LOAD:INA219:C2.2
  pour Top (no thermals): 60.42,30.93 61.32,30.93 61.32,32.53 60.42,32.53
ADJUSTABLE_LOAD:LOAD_LOW
  pour Bottom (no thermals): 54.15,24.5 60.37,24.5 60.37,23.5 54.15,23.5
ADJUSTABLE_LOAD:SENSE_AMP_IN-  (via drill 0.35)
  Top 0.25: ADJUSTABLE_LOAD:R4.1 ADJUSTABLE_LOAD:R1.2 | ADJUSTABLE_LOAD:IC4.4 46.35,27.02 v46.38,27
  Route15 0.25: v46.38,27 46.75,27 47.25,26.5 47.25,23.25 46.62,22.62 ADJUSTABLE_LOAD:R1.2
  other vias: 46.12,22.62
ADJUSTABLE_LOAD:VSENSE  (via drill 0.35)
  Top 0.5: ADJUSTABLE_LOAD:IC4.3 v46.33,24.66
  Bottom 0.5: v46.33,24.66 45.16,24.66 ADJUSTABLE_LOAD:IC3.S2
  pour Bottom (no thermals): 41.6,26.8 45.25,26.8 45.25,23.65 43.85,23.65 42.52,24.98 41.6,24.98
ADJUSTABLE_LOAD:VSENSE-AMP_OUT
  Top 0.25: ADJUSTABLE_LOAD:IC2.4 43.75,24.93 | 43.75,24.93 44.23,24.93 ADJUSTABLE_LOAD:IC4.1 | ADJUSTABLE_LOAD:R4.2 43.75,22.75 43.75,24.93
ADXL_INT1  (via drill 0.35)
  Top 0.25: v31.66,9 31.75,9.09 STM32L4:IC1.P$15 | ACCELEROMETER:IC1.5_INT1 81.39,32.94 81.39,32.15 v81.25,32
  Route3 0.25: v31.66,9 32.41,9.75 35.5,9.75 37.69,7.56 54.64,7.56 56.7,5.5 57,5.5 74.25,5.5 81.75,13 81.75,31.5 v81.25,32
APP_LOW  (via drill 0.35)
  Route2 0.25: v2.5,29.38 v5,29.38
  Route15 0.25: v55.25,27.75 v54.5,27.75 49.5,32.75 22.59,32.75 21.59,31.75 15.5,31.75 13,29.25 5.12,29.25 v5,29.38
  Bottom 0.25: ADJUSTABLE_LOAD:Q3.3 v55.25,27.75
  other vias: 5,30.12 5,28.62 2.5,30.12 2.5,28.62
  pour Top (no thermals): 2.02,30.5 5.47,30.5 5.47,28.25 2.02,28.25
  pour Bottom (no thermals): 5.47,30.5 2.02,30.5 2.02,28.25 5.47,28.25
APPL  (via drill 0.35)
  Top 0.25: STM32L4:IC1.P$29 39.25,13.5 v39.5,13.25
  Route3 0.25: v39.5,13.25 38.94,13.81 28.32,13.81 26.91,15.22 26.91,16.18 28.54,17.81 30.4,17.81 32.16,19.57 32.16,20.25 31.82,20.58 31.82,21.34 34.84,21.34 39.75,26.25 52,26.25 52.41,26.66 v52.41,26.75
  Bottom 0.25: v52.41,26.75 52.46,26.8 ADJUSTABLE_LOAD:Q3.1
BAT+  (via drill 0.35)
  Top 0.5: v15,8.12 RECTIFIER:D1.A v15.75,8.12
  Route3 0.5: v2.5,10.38 v5,10.38 11.5,10.38 13.75,8.12 v15,8.12 v15.75,8.12
  other vias: 2.5,11.12 5,11.12 5,9.62 2.5,9.62
  pour Top (no thermals): 2.02,11.5 5.47,11.5 5.47,9.25 2.02,9.25
  pour Bottom (no thermals): 5.5,11.55 2,11.55 2,9.2 5.5,9.2
BLUETOOTH:EAN
  Top 0.25: BLUETOOTH:R3.1 66.97,11.78 BLUETOOTH:IC1.20
BLUETOOTH:P2_0
  Top 0.25: BLUETOOTH:R1.1 66.97,14.03 BLUETOOTH:IC1.18
BLUETOOTH:P2_4
  Top 0.25: BLUETOOTH:R2.1 BLUETOOTH:IC1.19
CAN_H  (via drill 0.35)
  Top 0.25: CAN_INFRA:IC1.P$7 20.43,4.62 19.62,4.62 19.05,4.05 CAN_INFRA:IC2.2 | CAN_INFRA:R3.2 15.8,4.05 CAN_INFRA:IC2.2 | CAN_INFRA:IC2.2 16.75,4 v16.5,4
  Route3 0.25: v2.5,3.38 v5,3.38 15.88,3.38 v16.5,4
  other vias: 2.5,4.38 5,4.38
  pour Top (no thermals): 2.02,4.67 5.47,4.67 5.47,3.08 2.02,3.08
  pour Bottom (no thermals): 5.47,4.67 2.02,4.67 2.02,3.08 5.47,3.08
CAN_INFRA:H
  Top 0.25: CAN_INFRA:R3.1 13.95,4 CAN_INFRA:R2.2
CAN_INFRA:L
  Top 0.25: CAN_INFRA:R4.1 13.7,6 CAN_INFRA:R1.1
CAN_INFRA:SPLIT
  pour Top (no thermals): 10.4,3.5 10.4,6.25 11.7,6.25 11.7,3.5
CAN_L  (via drill 0.35)
  Top 0.25: CAN_INFRA:IC1.P$6 20.43,5.38 19.62,5.38 19.05,5.95 CAN_INFRA:IC2.1 16.55,5.95 v16.5,6 CAN_INFRA:R4.2
  Route3 0.25: v2.5,6.38 v5,6.38 16.12,6.38 v16.5,6
  other vias: 2.5,5.38 5,5.38
  pour Top (no thermals): 2.02,6.67 5.47,6.67 5.47,5.08 2.02,5.08
  pour Bottom (no thermals): 5.47,6.67 2.02,6.67 2.02,5.08 5.47,5.08
DAC  (via drill 0.35)
  Top 0.25: STM32L4:IC1.P$14 31.25,10 v30.75,9.5
  Route15 0.25: v30.75,9.5 34.75,13.5 36.84,13.5 38.84,15.5 38.84,17.32 35.91,20.25 35.91,21.5 36.91,22.5 ADJUSTABLE_LOAD:R7.1 42.12,21 TP6.P$1
  other vias: 42.12,22.5
DYNAMO1  (via drill 0.35)
  Top 0.5: 4.95,46.42 5,46.42 | RECTIFIER:ZERO-CROSS_DETECTOR:R1.1 v40.75,30.75
  Route2 0.5: v56.25,39.25 56.25,40.5 51.25,40.5 v51.25,39.25 51.25,38 46.55,38 46.55,40.5 44,40.5 44,38 41.5,38 41.5,40.5 34.25,40.5 | 34.25,40.5 29.25,40.5 v29.25,39.25 29.25,38 | 34.25,40.5 v34.25,39.25 | v2.5,47.38 v5,47.38 13.38,47.38 15.25,45.5 15.25,39.75 17,38 29.25,38 | 29.25,38 33.5,33.75 38.75,33.75 40.75,31.75 v40.75,30.75
  Bottom 0.5: RECTIFIER:GRAETZ+DELON:TUNING_CAPS:SSR_NO/NO1:IC1.8_DRAIN1-2 51.25,39.71 v51.25,39.25 | RECTIFIER:GRAETZ+DELON:TUNING_CAPS:SSR_NO/NO3:IC1.8_DRAIN1-2 29.25,39.71 v29.25,39.25 | RECTIFIER:GRAETZ+DELON:TUNING_CAPS:SSR_NO/NO3:IC1.6_DRAIN2-2 34.27,39.27 v34.25,39.25 | RECTIFIER:GRAETZ+DELON:TUNING_CAPS:SSR_NO/NO1:IC1.6_DRAIN2-2 56.27,39.27 v56.25,39.25
  Bottom 1: CONN1.94 15.75,47.38 RECTIFIER:DYNAMO_OVP:D4.A
  other vias: 2.5,48.12 5,48.12 2.5,46.62 5,46.62
  pour Bottom (rank 2, no thermals): 5.5,48.58 2,48.58 2,46.2 5.5,46.2
  pour Top (no thermals): 2.03,48.55 10.18,48.55 11.23,47.5 12.55,47.5 12.55,46.25 14.55,46.25 14.55,45.45 11.45,45.45 10.72,46.18 2.03,46.18
DYNAMO2  (via drill 0.35)
  Bottom 0.5: 12.5,44.38 RECTIFIER:DYNAMO_OVP:D3.A
  Bottom 1: CONN1.88 12.5,44.38
  other vias: 2.5,43.62 2.5,45.12 5,45.12 5,43.62 2.5,44.38 5,44.38
  pour Bottom (no thermals): 5.5,45.55 2,45.55 2,43.2 5.5,43.2
  pour Top (no thermals): 17.78,42.9 19.38,42.9 19.38,40.68 19.05,40.35 19.05,39.35 17.95,39.35 17.95,40.35 17.78,40.52
  pour Top (no thermals): 2.03,45.57 2.03,43.18 15.69,43.18 17.77,41.1 19.38,41.1 19.38,42.91 17.41,44.88 10.37,44.88 9.68,45.57
GND  (via drill 0.35, 3 pad 5)
  Top 0.25: ACCELEROMETER:IC1.11_GND 81.88,36.88 | ACCELEROMETER:IC1.1_SCLK 80.76,34.99 80.38,35.38 | v31.5,16.25 31.25,16.5 STM32L4:IC1.P$47 | v35.5,12.25 35.75,12.25 STM32L4:IC1.P$23 35.75,9 | v31.5,12.25 31.5,13.25 31.25,13.5 STM32L4:IC1.P$8 25.5,13.5 25.5,14.4 STM32L4:C4.1 | STM32L4:IC1.PAD v35.5,16.25 35.5,16.5 STM32L4:IC1.P$35 36.91,16.54 37.37,16.54 37.84,17 38.75,17
  Top 0.5: v19.25,14.5 RECTIFIER:3V3:IC2.GND v17.75,14.5
  Bottom 0.25: v64.25,15 64.25,14.54 63.15,13.45 SD_CARD:IC3.17 63.15,8.9 62.75,8.5 | 11.75,15.25 11.88,15.38 IC2.GND 14.38,15.38 v14.5,15.25 | 12.12,25.88 12,25.75 | 14.25,25.75 14.12,25.88 IC1.GND 9.88,25.88 9.75,26
  other vias: 85.5,3.5 85.5,48.25 88,20 88,24 88,28 80,0.88 75,0.88 70,0.88 65,0.88 60,0.88 55,0.88 50,0.88 45,0.88 40,0.88 35,0.88 30,0.88 25,0.88 20,0.88 15,0.88 10,0.88 80,50.88 75,50.88 70,50.88 65,50.88 60,50.88 55,50.88 50,50.88 45,50.88 40,50.88 35,50.88 30,50.88 25,50.88 20,50.88 15,50.88 10,50.88 18.5,5 24.5,4.25 21.75,5 12.75,4.88 22.25,12 18.5,14.5 63.12,22.88 63.12,25.88 63.12,28.88 28.25,31.5 88,8 88,32 88,36 88,40 88,44 1.5,50.38 1.5,49.38 1.5,24.38 1.5,23.38 1.5,19.38 1.5,18.38 1.5,2.38 1.5,1.38 5,50.38 5,49.38 5,24.38 5,23.38 5,19.38 5,18.38 5,2.38 5,1.38 77,33.62 20.75,33 20,35.5 21.5,14.5 82.25,5.62 65.25,4.5 75.38,9.75 85.5,34.12 67.62,22.88 67.62,25.88 67.62,28.88 72.12,22.88 72.12,25.88 72.12,28.88 80.62,19.88 64.75,31.5 63.88,34.5 29.25,34 39.5,9.25 28.75,21.25 30,21.25 64.75,7 35.88,3.12 28.62,6.88 9.5,42.38 54.5,19.75 49,20.5 41,20.75 39.5,23.5 38.5,28.5 27,24 23,20.75 23.75,30.25 21.75,10.25 26,7.5 12.25,11.75 18.5,16.75 12,27.75 12,23.5 16,32.75 11.25,31.25 23.25,35.5 32.5,30.75 33.25,30.75 34,30.75 36.75,32 37.75,32 35.75,32 11.5,48.75 12.5,48.75 21.75,48.75 22.75,48.75 24.25,39.25 24,44 45.5,30.75 76.25,31.5 71.75,34.75 71.75,33 82.75,37.75 81,37.75 83.25,33.25 80.75,21.75 76.75,18.25 70.75,15 78.5,5.5 59.5,6.25 30.25,25.75 35.5,25.75 33,28 38.5,39.25 26.75,39.25 49.5,39.25 53.75,38 66,38 68.5,38 76,37.75 84,20 84,12 84,16 81,11 84,7 78.5,8 68.5,45.25 81,8 72.75,18
  pour Route3 (isolate 0.406, rank 6, no thermals): -1,-1 90,-1 90,53 -1,53
  pour Top (isolate 0.305, rank 6): 90,53 -1,53 -1,-1 90,-1
  pour Route14 (isolate 0.406, rank 6, no thermals): -1,-1 90,-1 90,53 -1,53
  pour Route15 (isolate 0.406, rank 6, no thermals): -1,-1 90,-1 90,53 -1,53
  pour Bottom (isolate 0.305, rank 6): -1,-1 90,-1 90,53 -1,53
  pour Top (no thermals): 1.02,50.67 6,50.67 6,49.08 1.02,49.08
  pour Top (no thermals): 1.02,24.68 6,24.68 6,23.2 1.02,23.2
  pour Top (no thermals): 1.02,19.55 6,19.55 6,18.07 1.02,18.07
  pour Top (no thermals): 1,2.67 6,2.67 6,1.07 1,1.07
  pour Bottom (no thermals): 6,50.67 1,50.67 1,49.08 6,49.08
  pour Bottom (no thermals): 6,24.68 1,24.68 1,23.2 6,23.2
  pour Bottom (no thermals): 6,19.55 1,19.55 1,18.07 6,18.07
  pour Bottom (no thermals): 6,2.67 1,2.67 1,1.07 6,1.07
  cutout Top: 84.75,20 89,20 89,8 84.75,8
  cutout Route2: 84.75,20 89,20 89,8 84.75,8
  cutout Route3: 84.75,20 89,20 89,8 84.75,8
  cutout Route14: 84.75,20 89,20 89,8 84.75,8
  cutout Route15: 84.75,20 89,20 89,8 84.75,8
  cutout Bottom: 84.75,20 89,20 89,8 84.75,8
  pour Top (rank 6, no thermals): 21.25,49.25 23.25,49.25 23.25,48 21.25,48
  pour Top (rank 6, no thermals): 11,49.25 13,49.25 13,48 11,48
  pour Top (rank 6, no thermals): 34.75,34 38.75,34 38.75,31.25 34.75,31.25
  pour Top (rank 6, no thermals): 31.75,32.75 34.75,32.75 34.75,30 31.75,30
  pour Bottom (rank 6, no thermals): 17.5,20.5 14.5,20.5 14.5,17.5 17.5,17.5
  pour Bottom (rank 6, no thermals): 37,29.5 28.75,29.5 28.75,22.5 37,22.5
  pour Bottom (rank 6, no thermals): 40.5,27.25 37.75,27.25 37.75,24.5 40.5,24.5
  pour Bottom (rank 6, no thermals): 66.25,6 64.25,6 64.25,3.5 66.25,3.5
  pour Bottom (rank 6, no thermals): 79.5,7 77.25,7 77.25,4.5 79.5,4.5
  pour Bottom (rank 6, no thermals): 77.75,20 76.1,20 76.1,17.75 77.75,17.75
  pour Bottom (rank 6, no thermals): 72.25,20 70,20 70,18 72.25,18
  pour Top (no thermals): 1.5,8.68 6.5,8.68 6.5,7.08 1.5,7.08
  pour Top (no thermals): 1.75,13.68 6.75,13.68 6.75,12.07 1.75,12.07
  pour Top (no thermals): 1.75,27.68 6.75,27.68 6.75,27.07 1.75,27.07
  pour Top (no thermals): 1.75,31.68 6.75,31.68 6.75,31.07 1.75,31.07
  pour Top (no thermals): 1.75,35.67 6.75,35.67 6.75,35.08 1.75,35.08
  pour Top (no thermals): 1.5,42.67 6.5,42.67 6.5,42.08 1.5,42.08
  pour Bottom (no thermals): 6.75,42.67 1.75,42.67 1.75,42.08 6.75,42.08
  pour Bottom (no thermals): 6.75,35.67 1.75,35.67 1.75,35.08 6.75,35.08
  pour Bottom (no thermals): 6.75,31.68 1.75,31.68 1.75,31.07 6.75,31.07
  pour Bottom (no thermals): 6.75,27.68 1.75,27.68 1.75,27.07 6.75,27.07
  pour Bottom (no thermals): 6.75,13.55 1.75,13.55 1.75,12.07 6.75,12.07
  pour Bottom (no thermals): 6.75,8.55 1.75,8.55 1.75,7.08 6.75,7.08
I2C_SCL  (via drill 0.35)
  Top 0.25: v76.75,32.62 76.65,32.62 76.3,32.98 HUMIDITY_SENSOR:IC1.SCL | v74.75,34.5 74.6,34.5 74.47,34.62 RECTIFIER:GRAETZ+DELON:IC1.14 | v79.88,32.62 80.38,33.13 ACCELEROMETER:IC1.4_!CS!/SCL | ADJUSTABLE_LOAD:INA219:IC3.P$5 v63.88,32.9 | INA1:IC3.P$5 12.53,29.78 14.78,29.78 v15,30 | STM32L4:IC1.P$42 33.75,21.5 v34.25,22 STM32L4:R2.1
  Route3 0.25: TP1.P$1 84.12,32.62 v79.88,32.62 v76.75,32.62 76.62,32.62 v74.75,34.5 71,30.75 66.84,30.75 64.69,32.9 v63.88,32.9 22.44,32.9 21.5,33.84 18.84,33.84 v15,30 16.75,28.25 29.75,28.25 34.25,23.75 v34.25,22
I2C_SDA  (via drill 0.35)
  Top 0.25: v76.75,34.62 76.65,34.62 76.3,34.27 HUMIDITY_SENSOR:IC1.SDA | v73.5,36.62 73.47,36.6 RECTIFIER:GRAETZ+DELON:IC1.15 | v79.88,34.62 80.37,34.13 ACCELEROMETER:IC1.2_MOSI/SDA | v12.5,31.88 13.18,31.88 INA1:IC3.P$6 | v66.12,34.9 66.12,33.77 65.9,33.55 ADJUSTABLE_LOAD:INA219:IC3.P$6 | STM32L4:IC1.P$43 33.25,21.5 v32.75,22 STM32L4:R1.1
  Route3 0.25: TP2.P$1 84.12,34.62 v79.88,34.62 v76.75,34.62 74.75,36.62 v73.5,36.62 67.85,36.62 v66.12,34.9 66,34.9 64.4,36.5 16.38,36.5 12.5,32.62 v12.5,31.88 12.5,29.25 19,22.75 32,22.75 v32.75,22
INA1:IN+L
  Top 0.25: INA1:IC3.P$1 14.48,34.33 INA1:C2.1 15.03,34.88 INA1:R5.1
INA1:IN-H
  Top 0.25: INA1:IC3.P$2 13.83,34.27 INA1:C2.2 13.22,34.88 INA1:R3.1
MJ8X8_8V4_H  (via drill 0.35)
  Top 0.5: INA1:R5.2 16.12,37.05 INA1:R4.1
  other vias: 2.5,41.12 2.5,40.38 2.5,39.62 5,39.62 5,40.38 5,41.12
  pour Bottom (no thermals): 5.5,41.55 2,41.55 2,39.2 5.5,39.2
  pour Top (no thermals): 2,39.25 2,41.57 14.18,41.57 16.35,39.4 16.35,36.72 14.75,36.72 14.75,38.52 14.02,39.25
MJ8X8_8V4_L  (via drill 0.35)
  Top 0.5: INA1:R3.2 12.12,37.05 INA1:R4.2
  other vias: 2.5,36.62 2.5,37.38 2.5,38.12 5,38.12 5,37.38 5,36.62
  pour Top (no thermals): 5.12,36.65 5.12,38.5 13.43,38.5 13.43,36.65
  pour Top (no thermals): 2.02,38.5 5.47,38.5 5.47,36.25 2.02,36.25
  pour Bottom (no thermals): 5.5,38.55 2,38.55 2,36.2 5.5,36.2
PHASE  (via drill 0.35)
  Top 0.25: STM32L4:IC1.P$12 30,11.5 v29.5,11 | RECTIFIER:PHASE_SHIFT:R1.2 v19,31
  Route3 0.25: v29.5,11 27.25,8.75 27.25,5.5 24.91,3.16 22.34,3.16 20.25,5.25 20.25,9.25 16.75,12.75 16.75,20.5 v10.75,26.5
  Route15 0.25: v19,31 19,30.91 14.59,26.5 v10.75,26.5 10.62,26.38 v5,26.38 v2.5,26.38
  Bottom 0.25: IC1.I4 10.97,26.5 v10.75,26.5
  pour Top: 2.12,26.62 5.38,26.62 5.38,26.12 2.12,26.12
  pour Bottom: 2.12,26.62 5.38,26.62 5.38,26.12 2.12,26.12
QSPI_CLK  (via drill 0.35)
  Top 0.25: STM32L4:IC1.P$21 34.75,8.5 35.25,8 35.25,6.5 v35,6.25
  Route15 0.25: v31.12,4.38 33.62,4.38 35,5.75 v35,6.25
  Bottom 0.25: M-RAM:IC1.6 31.11,4.37 v31.12,4.38
QSPI_IO0  (via drill 0.35)
  Top 0.25: STM32L4:IC1.P$19 33.75,6.75 v34.25,6.25
  Route3 0.25: v34.25,6.25 34.25,4.25 33.12,3.12 v31.12,3.12
  Bottom 0.25: v31.12,3.12 31.09,3.1 M-RAM:IC1.5
QSPI_IO1  (via drill 0.35)
  Top 0.25: v35.88,5.62 33.88,5.62 33.25,6.25 STM32L4:IC1.P$18
  Bottom 0.25: M-RAM:IC1.2 v35.88,5.62
QSPI_IO2  (via drill 0.35)
  Top 0.25: v35.88,4.38 35.38,4.88 33.62,4.88 32.75,5.75 STM32L4:IC1.P$17
  Bottom 0.25: M-RAM:IC1.3 v35.88,4.38
QSPI_IO3  (via drill 0.35)
  Top 0.25: STM32L4:IC1.P$16 32.25,6.25 31.62,5.62 v31.12,5.62
  Bottom 0.25: M-RAM:IC1.7 v31.12,5.62
RECTIFIER:3V3:!EN!
  Top 0.5: RECTIFIER:3V3:IC2.EN RECTIFIER:3V3:IC1.4_DOUT 20.05,16.05 RECTIFIER:3V3:R1.2
RECTIFIER:3V3:CD  (via drill 0.35)
  Top 0.25: RECTIFIER:3V3:IC1.5_CD 20.05,12.8 RECTIFIER:3V3:C1.1 v20.75,12
RECTIFIER:AC  (via drill 0.35)
  Top 0.5: RECTIFIER:PHASE_SHIFT:R2.1 v21.5,39.75
  Route2 0.5: v21.5,39.75 23.25,41.5 42.75,41.5 v42.75,39.25
  Bottom 0.5: RECTIFIER:GRAETZ+DELON:TUNING_CAPS:SSR_NO/NO4:IC1.7_DRAIN1-1 42.75,39.75 v42.75,39.25
  pour Top (no thermals): 19.7,46.25 19.7,45.45 22.8,45.45 22.8,47.5 21.7,47.5 21.7,46.25
  pour Top (no thermals): 22.05,39.35 20.95,39.35 20.95,40.35 20.62,40.68 20.62,45.5 22.22,45.5 22.22,40.52 22.05,40.35
RECTIFIER:DYNAMO_OVP:ZENER_COMMON
  Bottom 1.27: RECTIFIER:DYNAMO_OVP:D3.C RECTIFIER:DYNAMO_OVP:D4.C
RECTIFIER:GRAETZ+DELON:!SW1!  (via drill 0.35)
  Top 0.25: RECTIFIER:GRAETZ+DELON:IC1.10 73.47,30.77 v73.5,30.75
  Route15 0.25: v31.73,48.2 31.73,44.02 35,40.75 58.52,40.75 59.65,39.62 59.65,39.6 64.5,34.75 64.5,33.75 67.5,30.75 v73.5,30.75
  Bottom 0.25: RECTIFIER:GRAETZ+DELON:TUNING_CAPS:SSR_NO/NO3:IC1.2_CATHODE1 v31.73,48.2
RECTIFIER:GRAETZ+DELON:!SW2!  (via drill 0.35)
  Top 0.25: RECTIFIER:GRAETZ+DELON:IC1.9 v72.5,31.38
  Route15 0.25: v42.73,48.2 42.73,48.02 49.5,41.25 58.88,41.25 65,35.12 65,34 67.62,31.38 v72.5,31.38
  Bottom 0.25: RECTIFIER:GRAETZ+DELON:TUNING_CAPS:SSR_NO/NO4:IC1.2_CATHODE1 v42.73,48.2
RECTIFIER:GRAETZ+DELON:!SW_CA!  (via drill 0.35)
  Top 0.25: RECTIFIER:GRAETZ+DELON:IC1.7 68.75,32.62 v68.5,32.38
  Route15 0.25: v36.81,48.2 36.81,49.06 37.75,50 46,50 47.8,48.2 v47.81,48.2 47.81,44.19 50.25,41.75 61.14,41.75 63.25,39.64 63.25,37.78 65.5,35.53 65.5,34.25 67.5,32.25 68.46,32.25 68.5,32.29 v68.5,32.38
  Bottom 0.25: RECTIFIER:GRAETZ+DELON:TUNING_CAPS:SSR_NO/NO3:IC1.4_CATHODE2 v36.81,48.2 | RECTIFIER:GRAETZ+DELON:TUNING_CAPS:SSR_NO/NO4:IC1.4_CATHODE2 v47.81,48.2
RECTIFIER:GRAETZ+DELON:!SW_CB!  (via drill 0.35)
  Top 0.25: RECTIFIER:GRAETZ+DELON:IC1.6 68,33.12 v67.75,32.88
  Route15 0.25: v67.75,32.88 67.62,32.88 67,33.5 67,35.03 63.75,38.28 63.75,42 63.25,42.5 63.25,44 64.73,45.48 v64.73,48.2 64.73,47.5 54.44,47.5 v53.73,48.2
  Bottom 0.25: RECTIFIER:GRAETZ+DELON:TUNING_CAPS:SSR_NO/NO1:IC1.2_CATHODE1 v53.73,48.2 | RECTIFIER:GRAETZ+DELON:TUNING_CAPS:SSR_NO/NO2:IC1.2_CATHODE1 v64.73,48.2
RECTIFIER:GRAETZ+DELON:!SW_CC!  (via drill 0.35)
  Top 0.25: RECTIFIER:GRAETZ+DELON:IC1.5 68,33.62 v67.75,33.88
  Route15 0.25: v67.75,33.88 67.75,34.5 71.25,38 71.25,46.75 v69.81,48.19 v69.81,48.2 69.81,48.94 68.75,50 59.75,50 58.81,49.06 v58.81,48.21
  Bottom 0.25: RECTIFIER:GRAETZ+DELON:TUNING_CAPS:SSR_NO/NO1:IC1.4_CATHODE2 v58.81,48.21 | RECTIFIER:GRAETZ+DELON:TUNING_CAPS:SSR_NO/NO2:IC1.4_CATHODE2 v69.81,48.2
RECTIFIER:GRAETZ+DELON:!SW_CD!  (via drill 0.35)
  Top 0.25: RECTIFIER:GRAETZ+DELON:IC1.4 68.75,34.12 v68.5,34.38
  Route15 0.25: v75.98,48.2 72,44.23 72,37.75 68.62,34.38 v68.5,34.38
  Bottom 0.25: RECTIFIER:GRAETZ+DELON:DELON:SSR_NO/NO3:IC1.2_CATHODE1 v75.98,48.2
RECTIFIER:GRAETZ+DELON:DELON  (via drill 0.35)
  Route2 0.5: v31.73,39.29 31.73,38.02 33,36.75 40.19,36.75 | 40.19,36.75 v40.19,39.29 | v45.27,39.29 45.27,36.75 | 45.27,36.75 40.19,36.75 | 45.27,36.75 62.19,36.75 | 62.19,36.75 v62.19,39.29 | 62.19,36.75 67.25,36.75 | v67.27,39.29 67.25,39.27 67.25,36.75 | v73.44,39.29 73.44,38.44 71.75,36.75 67.25,36.75
  Bottom 0.5: RECTIFIER:GRAETZ+DELON:TUNING_CAPS:SSR_NO/NO3:IC1.7_DRAIN1-1 v31.73,39.29 | RECTIFIER:GRAETZ+DELON:TUNING_CAPS:SSR_NO/NO4:IC1.8_DRAIN1-2 v40.19,39.29 | RECTIFIER:GRAETZ+DELON:TUNING_CAPS:SSR_NO/NO4:IC1.6_DRAIN2-2 v45.27,39.29 | RECTIFIER:GRAETZ+DELON:TUNING_CAPS:SSR_NO/NO2:IC1.8_DRAIN1-2 v62.19,39.29 | RECTIFIER:GRAETZ+DELON:TUNING_CAPS:SSR_NO/NO2:IC1.6_DRAIN2-2 v67.27,39.29 | RECTIFIER:GRAETZ+DELON:DELON:SSR_NO/NO3:IC1.8_DRAIN1-2 v73.44,39.29
RECTIFIER:GRAETZ+DELON:DELON:SW1_OUT  (via drill 0.35)
  Route2 0.5: v75.98,39.29 75.98,43.23 RECTIFIER:GRAETZ+DELON:DELON:C1.2_MID
  Bottom 0.5: RECTIFIER:GRAETZ+DELON:DELON:SSR_NO/NO3:IC1.7_DRAIN1-1 v75.98,39.29
RECTIFIER:GRAETZ+DELON:SSR_ANODE  (via drill 0.35)
  Top 0.25: v78.5,49.12 78.55,49.08 RECTIFIER:GRAETZ+DELON:R1.1
  Bottom 0.25: RECTIFIER:GRAETZ+DELON:TUNING_CAPS:SSR_NO/NO3:IC1.1_ANODE1 v29.19,49.17 | RECTIFIER:GRAETZ+DELON:TUNING_CAPS:SSR_NO/NO3:IC1.3_ANODE2 v34.27,49.17 | RECTIFIER:GRAETZ+DELON:TUNING_CAPS:SSR_NO/NO4:IC1.1_ANODE1 v40.19,49.17 | RECTIFIER:GRAETZ+DELON:TUNING_CAPS:SSR_NO/NO4:IC1.3_ANODE2 v45.27,49.17 | RECTIFIER:GRAETZ+DELON:TUNING_CAPS:SSR_NO/NO1:IC1.1_ANODE1 v51.19,49.17 | RECTIFIER:GRAETZ+DELON:TUNING_CAPS:SSR_NO/NO1:IC1.3_ANODE2 v56.27,49.17 | RECTIFIER:GRAETZ+DELON:TUNING_CAPS:SSR_NO/NO2:IC1.1_ANODE1 v62.19,49.17 | RECTIFIER:GRAETZ+DELON:TUNING_CAPS:SSR_NO/NO2:IC1.3_ANODE2 v67.27,49.17 | RECTIFIER:GRAETZ+DELON:DELON:SSR_NO/NO3:IC1.1_ANODE1 v73.44,49.17 | RECTIFIER:GRAETZ+DELON:DELON:SSR_NO/NO3:IC1.3_ANODE2 78.5,48.71 v78.5,49.12
  pour Route2 (no thermals): 28.75,49.75 28.75,48.75 79,48.75 79,49.75
RECTIFIER:GRAETZ+DELON:TUNING_CAPS:CAA  (via drill 0.35)
  Bottom 0.5: RECTIFIER:GRAETZ+DELON:TUNING_CAPS:C2.1_C 36.81,43.1 RECTIFIER:GRAETZ+DELON:TUNING_CAPS:SSR_NO/NO3:IC1.5_DRAIN2-1 v36.81,39.29
RECTIFIER:GRAETZ+DELON:TUNING_CAPS:CAB  (via drill 0.35)
  Route2 0.5: RECTIFIER:GRAETZ+DELON:TUNING_CAPS:C2.3_C 45.5,43.25 47.81,40.94 v47.81,39.29
  Bottom 0.5: RECTIFIER:GRAETZ+DELON:TUNING_CAPS:SSR_NO/NO4:IC1.5_DRAIN2-1 v47.81,39.29
RECTIFIER:GRAETZ+DELON:TUNING_CAPS:CBA  (via drill 0.35)
  Bottom 0.5: RECTIFIER:GRAETZ+DELON:TUNING_CAPS:C3.1_C 53.73,43.23 RECTIFIER:GRAETZ+DELON:TUNING_CAPS:SSR_NO/NO1:IC1.7_DRAIN1-1 53.75,39.75 v53.75,39.25
RECTIFIER:GRAETZ+DELON:TUNING_CAPS:CBB  (via drill 0.35)
  Route2 0.5: RECTIFIER:GRAETZ+DELON:TUNING_CAPS:C3.3_C 62,43.25 64.73,40.52 v64.73,39.29
  Bottom 0.5: RECTIFIER:GRAETZ+DELON:TUNING_CAPS:SSR_NO/NO2:IC1.7_DRAIN1-1 v64.73,39.29
RECTIFIER:GRAETZ+DELON:TUNING_CAPS:CCA  (via drill 0.35)
  Route3 0.5: RECTIFIER:GRAETZ+DELON:TUNING_CAPS:C4.1_C 62.75,43.25 v58.75,39.25
  Bottom 0.5: RECTIFIER:GRAETZ+DELON:TUNING_CAPS:SSR_NO/NO1:IC1.5_DRAIN2-1 58.81,39.31 v58.75,39.25
RECTIFIER:GRAETZ+DELON:TUNING_CAPS:CCB  (via drill 0.35)
  Route2 0.5: v69.81,40.26 69.79,40.27 RECTIFIER:GRAETZ+DELON:TUNING_CAPS:C4.3_C
  Bottom 0.5: RECTIFIER:GRAETZ+DELON:TUNING_CAPS:SSR_NO/NO2:IC1.5_DRAIN2-1 v69.81,40.26
RECTIFIER:GRAETZ+DELON:TUNING_CAPS:TUNING_CAP_BIAS  (via drill 0.35)
  Route2 0.5: RECTIFIER:GRAETZ+DELON:TUNING_CAPS:C2.2_MID 39.5,44.76 | 39.5,44.76 56.25,44.76 | RECTIFIER:GRAETZ+DELON:TUNING_CAPS:C3.2_MID 56.25,44.76 | RECTIFIER:GRAETZ+DELON:TUNING_CAPS:C4.2_MID 65.75,44.75 65.75,44.76 56.25,44.76 | v26.5,43.25 27.5,43.25 29.01,44.76 39.5,44.76
  Bottom 0.5: RECTIFIER:GRAETZ+DELON:TUNING_CAPS:R2.1 v26.5,43.25
RECTIFIER:LDO_IN  (via drill 0.35)
  Top 0.5: RECTIFIER:3V3:IC1.1_VDD 22.95,13.55 v23,13.5 | RECTIFIER:3V3:IC2.IN 18.5,13.45 v18.5,13.25 | RECTIFIER:D2.C RECTIFIER:D1.C
  Route3 0.5: v18.5,13.25 22.75,13.25 v23,13.5 23,16 RECTIFIER:3V3:R1.1
  other vias: 22,17
  pour Top (no thermals): 19,13.75 17.8,13.75 17.8,12.7 17.55,12.45 17.55,11.35 17.15,10.95 17.15,9.45 19,9.45
RECTIFIER:PHASE_SHIFT:OPAMP_IN+
  Top 0.25: RECTIFIER:PHASE_SHIFT:R2.2 21.5,37.2 21.31,37.2 RECTIFIER:PHASE_SHIFT:IC1.3
RECTIFIER:PHASE_SHIFT:OPAMP_IN-
  Top 0.25: RECTIFIER:PHASE_SHIFT:R3.2 18.5,37.2 18.69,37.2 RECTIFIER:PHASE_SHIFT:IC1.4
RECTIFIER:PHASE_SHIFT:OPAMP_OUT
  Top 0.25: RECTIFIER:PHASE_SHIFT:IC1.1 22.05,33.8 22.05,32.2 RECTIFIER:PHASE_SHIFT:R1.1
RECTIFIER:SMOOTHINGCAP_IN  (via drill 0.35)
  Route2 0.5: RECTIFIER:GRAETZ+DELON:DELON:C1.1_POS 73.46,43.26 70.22,46.5 26.5,46.5 | RECTIFIER:GRAETZ+DELON:D3.A 21.5,46.5 26.5,46.5 | v26.5,45.25 26.5,46.5
  Bottom 0.5: RECTIFIER:GRAETZ+DELON:TUNING_CAPS:R2.2 v26.5,45.25
  other vias: 20.25,47.75
  pour Top (no thermals): 13.45,46.75 13.45,48.8 20.8,48.8 20.8,46.75 19.7,46.75 19.7,48 14.55,48 14.55,46.75
RECTIFIER:ZERO-CROSS_DETECTOR:OPAMP_IN+
  Top 0.5: RECTIFIER:ZERO-CROSS_DETECTOR:R2.2 30.7,34.95 RECTIFIER:ZERO-CROSS_DETECTOR:IC1.P$3
RECTIFIER:ZERO-CROSS_DETECTOR:OPAMP_OUT
  Top 0.25: RECTIFIER:ZERO-CROSS_DETECTOR:R3.1 30.7,33.05 RECTIFIER:ZERO-CROSS_DETECTOR:IC1.P$1
RECTIFIER:ZERO-CROSS_DETECTOR:ZC_LP_OUT
  pour Top (no thermals): 42.38,37.5 42.38,35.62 32.12,35.62 31.62,36.12 30.25,36.12 30.25,37.12 31.75,37.12 32.12,37.5
RN4678_CONNSTAT  (via drill 0.35)
  Top 0.25: STM32L4:IC1.P$4 v28.5,15.5 | BLUETOOTH:IC1.12 v70.75,17.5
  Route3 0.25: v28.5,15.5 38.5,15.5 39.75,16.75 59.75,16.75 62.75,19.75 68.5,19.75 v70.75,17.5
RN4678_CTS  (via drill 0.35)
  Top 0.25: STM32L4:IC1.P$32 41.25,15 v41.75,14.5 | BLUETOOTH:IC1.17 v66.75,15.1
  Route3 0.25: v41.75,14.5 59,14.5 61.25,12.25 66,12.25 66.7,12.95 66.7,15.05 v66.75,15.1
RN4678_RST  (via drill 0.35)
  Top 0.25: STM32L4:IC1.P$20 34.25,8 v34.5,7.75 | v67.63,9.41 67.29,9.41 67,9.7 BLUETOOTH:IC1.21
  Route15 0.25: v67.63,9.41 65.13,9.41 62.88,7.16 36.84,7.16 36.25,7.75 v34.5,7.75
RN4678_RTS  (via drill 0.35)
  Top 0.25: STM32L4:IC1.P$33 42,15.5 v42.25,15.25 | BLUETOOTH:IC1.15 66.8,17.3 v66.75,17.25
  Route3 0.25: v42.25,15.25 60.25,15.25 62.25,13.25 65.25,13.25 65.75,13.75 65.75,16.25 v66.75,17.25
RN4678_RX  (via drill 0.35)
  Top 0.25: BLUETOOTH:IC1.23 69.65,9 69.38,9.28 69.38,9.38 v69.12,9.62 | STM32L4:IC1.P$31 40.25,14.5 v40.75,14
  Route3 0.25: v40.75,14 41,13.75 58.75,13.75 61.38,11.12 67.62,11.12 v69.12,9.62
  Route15 0.25: v69.12,9.62 69.34,9.41 69.34,7.38 67.96,6 65,6 TP3.P$1
RN4678_TRANSSTAT  (via drill 0.35)
  Top 0.25: STM32L4:IC1.P$3 28.84,16 28.75,16.09 27.84,16.09 v27.5,15.75 | BLUETOOTH:IC1.11 71.85,17.5 v71.75,17.5
  Route3 0.25: v27.5,15.75 27.5,15.5 28.25,14.75 38.75,14.75 40,16 60.25,16 63,18.75 68,18.75 70,16.75 71,16.75 v71.75,17.5
RN4678_TX  (via drill 0.35)
  Top 0.25: BLUETOOTH:IC1.22 68.5,8.3 v68.5,8.62 | STM32L4:IC1.P$30 39.75,14 v40.5,13.25
  Route3 0.25: v40.5,13.25 40.75,13 58.25,13 60.75,10.5 62.5,10.5 64.38,8.62 v68.5,8.62
  Route15 0.25: v68.5,8.62 64.97,8.62 63.06,6.72 62.72,6.72 TP4.P$1
RN4678_WKUP  (via drill 0.35)
  Top 0.25: STM32L4:IC1.P$41 34.25,19.25 v35,20 | BLUETOOTH:IC1.9 74,19.8 v74,20.25
  Route3 0.25: v74,20.25 72.75,21.5 55.25,21.5 53,23.75 52,23.75 50,21.75 47,21.75 | v35,20 35.25,20 37,21.75 47,21.75 | 47,21.75 TP5.P$1
RXCAN  (via drill 0.35)
  Top 0.25: CAN_INFRA:IC1.P$4 23.02,6.03 v23.25,6.25 | STM32L4:IC1.P$45 32.25,19.29 31.57,19.97 v31.57,20
  Route3 0.25: v23.25,6.25 24,7 24,17.91 26.43,20.34 29,20.34 29.34,20 v31.57,20
SD_CARD:CLK_EX
  Bottom 0.2: SD_CARD:IC3.11 71.92,12.2 74.26,9.87 SD_CARD:IC1.CLK
SD_CARD:CMD_EX
  Bottom 0.2: SD_CARD:IC3.12 70.2,11.8 72.06,9.94 SD_CARD:IC1.CMD
SD_CARD:DAT0_EX
  Bottom 0.2: SD_CARD:IC3.10 73.78,12.6 76.46,9.91 SD_CARD:IC1.DATA0
SD_CARD:DAT1_EX
  Bottom 0.2: SD_CARD:IC3.9 74.5,13 77.56,9.94 SD_CARD:IC1.DATA1
SD_CARD:DAT2_EX
  Bottom 0.2: SD_CARD:IC3.14 68.75,11 69.86,9.89 SD_CARD:IC1.DATA2
SD_CARD:DAT3_EX
  Bottom 0.2: SD_CARD:IC3.13 69.47,11.4 70.96,9.91 SD_CARD:IC1.CD/DATA3
SDMMC_CLK  (via drill 0.35)
  Top 0.25: STM32L4:IC1.P$25 37,11.5 v37.5,11
  Route3 0.25: v37.5,11 38.25,10.25 39.75,10.25 40.5,11 v56,11
  Bottom 0.2: SD_CARD:IC3.6 57.2,12.2 v56,11
SDMMC_CMD  (via drill 0.35)
  Top 0.25: STM32L4:IC1.P$11 29.25,12 v28.75,11.5
  Route3 0.25: v28.75,11.5 29,11.75 30.09,11.75 31.34,10.5 35.62,10.5 37.62,8.5 40,8.5 41.5,10 56,10 v57.5,11.5
  Bottom 0.2: SD_CARD:IC3.5 57.8,11.8 v57.5,11.5
SDMMC_DATA0  (via drill 0.35)
  Top 0.25: STM32L4:IC1.P$27 38.25,12.5 v39,11.75
  Route15 0.25: v39,11.75 42.25,8.5 58.25,8.5 59.25,9.5 59.25,12 60.5,13.25 v61.25,13.25
  Bottom 0.2: SD_CARD:IC3.7 61.9,12.6 v61.25,13.25
SDMMC_DATA1  (via drill 0.35)
  Top 0.25: STM32L4:IC1.P$28 38.75,13 39.25,12.5 v39.5,12.5
  Route15 0.25: v39.5,12.5 43,9 58,9 58.75,9.75 58.75,12.25 60.5,14 v62.5,14
  Bottom 0.2: SD_CARD:IC3.8 62.5,13 v62.5,14
SDMMC_DATA2  (via drill 0.35)
  Top 0.25: v37.75,19.5 36.25,19.5 35.25,18.5 STM32L4:IC1.P$39
  Route15 0.25: v58,10 57.5,9.5 50,9.5 40,19.5 v37.75,19.5
  Bottom 0.2: SD_CARD:IC3.3 59,11 v58,10
SDMMC_DATA3  (via drill 0.35)
  Top 0.25: STM32L4:IC1.P$40 34.75,18.75 36.25,20.25 v37,20.25
  Route15 0.25: v37,20.25 40,20.25 50.25,10 57,10 v57.75,10.75
  Bottom 0.2: SD_CARD:IC3.4 58.4,11.4 v57.75,10.75
SDMMC_DET  (via drill 0.35)
  Top 0.25: STM32L4:IC1.P$26 37.5,12 v37.75,11.75
  Route3 0.25: v37.75,11.75 38.5,11 39.5,11 40.75,12.25 58,12.25 60.5,9.75 v62,9.75 64,7.75 69,7.75 75.25,14 v75.25,18.25
  Bottom 0.2: SD_CARD:IC3.1 62.45,10.2 v62,9.75
  Bottom 0.25: SD_CARD:IC1.CARD_DETECT 75.36,18.36 v75.25,18.25
  pour Bottom (no thermals): 74.89,18.75 75.83,18.75 75.83,17.75 74.89,17.75
STM32L4:VDDUSB  (via drill 0.35)
  Top 0.25: STM32L4:IC1.P$36 37,17 v37.5,17.5
SYS_NRST  (via drill 0.35)
  Top 0.25: v5,14.38 CONN1.28 v2.5,14.38 | STM32L4:IC1.P$7 27.12,14 27,14.12 v27,14.25 26.9,14.35 STM32L4:C4.2
  Route2 0.25: v2.5,14.38 v5,14.38 5.12,14.5 v10.75,14.5
  Route15 0.25: v27,14.25 24,11.25 14,11.25 v10.75,14.5
  Bottom 0.25: CONN1.28 v5,14.38 | v10.75,14.5 10.97,14.72 IC2.I3
  pour Top: 2.12,14.62 5.38,14.62 5.38,14.12 2.12,14.12
  pour Bottom: 2.12,14.62 5.38,14.62 5.38,14.12 2.12,14.12
SYS_SWCLK  (via drill 0.35)
  Top 0.25: v5,15.38 CONN1.30 v2.5,15.38 | v36.75,18 36.5,18 36.25,17.75 STM32L4:IC1.P$37
  Route3 0.25: v2.5,15.38 v5,15.38 12.12,15.38 v13,16.25
  Route15 0.25: v36.75,18 36.25,18 35.75,18.5 15.25,18.5 v13,16.25
  Bottom 0.25: CONN1.30 v5,15.38 | IC2.I1 v13,16.25
  pour Top: 2.12,15.62 5.38,15.62 5.38,15.12 2.12,15.12
  pour Bottom: 2.12,15.62 5.38,15.62 5.38,15.12 2.12,15.12
SYS_SWDIO  (via drill 0.35)
  Top 0.25: v5,16.38 CONN1.32 v2.5,16.38 | STM32L4:IC1.P$34 37.99,16 v38.24,16.25 v38.25,16.25
  Route3 0.25: v2.5,16.38 v5,16.38 10.62,16.38 v10.75,16.25
  Route15 0.25: v10.75,16.25 12,16.25 12.79,15.46 13.21,15.46 15.5,17.75 35.59,17.75 37.09,16.25 v38.25,16.25
  Bottom 0.25: CONN1.32 v5,16.38 | v10.75,16.25 10.78,16.25 IC2.I4
  pour Top: 2.12,16.62 5.38,16.62 5.38,16.12 2.12,16.12
  pour Bottom: 2.12,16.62 5.38,16.62 5.38,16.12 2.12,16.12
TXCAN  (via drill 0.35)
  Top 0.25: STM32L4:IC1.P$46 31.71,17.66 31.71,18.53 31.25,19 v31,19.25 | v23.21,3.75 23.02,3.94 CAN_INFRA:IC1.P$1
  Route3 0.25: v23.21,3.75 23.25,3.79 23.25,5.41 24.5,6.66 24.5,17.25 26.25,19 30.25,19 30.5,19.25 v31,19.25
VDC  (via drill 0.35)
  Top 0.5: RECTIFIER:D2.A v15.75,10.25 | ADJUSTABLE_LOAD:INA219:R4.1 58.3,35.12 v58.38,35.12 | RECTIFIER:SMOOTHING_CAP:D8.A v17.13,46.5
  Route3 0.5: v15,10.25 v15.75,10.25
  Route14 0.5: v17.13,46.5 17.25,46.38 17.25,34.25 | 17.25,34.25 7.62,34.25 6.75,33.38 v5,33.38 | 17.25,26.5 17.25,20 15.75,18.5 v15.75,10.25 | v21,26.5 v19.75,26.5 v18.5,26.5 17.25,26.5 | 17.25,34.25 17.25,26.5
  Route15 0.5: v2.5,33.38 v5,33.38 5.5,33.38 6.5,34.38 24.88,34.38 25.62,35.12 v58.38,35.12
  Bottom 0.5: v18.5,26.5 19.25,26.5 RECTIFIER:SMOOTHING_CAP:C1.+ 19.75,26 v19.75,26.5
  other vias: 2.5,32.62 2.5,34.12 5,32.62 5,34.12 57.38,35.12
  pour Top (no thermals): 2.02,34.5 5.47,34.5 5.47,32.25 2.02,32.25
  pour Bottom (no thermals): 5.47,34.5 2.02,34.5 2.02,32.25 5.47,32.25
  pour Top (no thermals): 56.99,35.49 56.99,33.89 58.9,33.89 59.92,34.92 59.92,35.62 58.9,35.62 58.77,35.49
ZEROCROSS  (via drill 0.35)
  Top 0.25: STM32L4:IC1.P$10 28.5,12.5 v28,12 | RECTIFIER:ZERO-CROSS_DETECTOR:R3.2 29.85,30.5 v29.5,30.5
  Route3 0.25: v2.5,25.38 v5,25.38 10.62,25.38 v10.75,25.25
  Route15 0.25: v29.5,30.5 24.25,25.25 v10.75,25.25 10.64,25.14 10.64,21.41 8.25,19.02 8.25,14.5 13.5,9.25 26.75,9.25 28,10.5 v28,12
  Bottom 0.25: IC1.I3 10.78,25.23 v10.75,25.25
  pour Bottom: 2.12,25.62 5.38,25.62 5.38,25.12 2.12,25.12
  pour Top: 2.12,25.62 5.38,25.62 5.38,25.12 2.12,25.12

## Text on the board
Top: GND | GND | GND | GND
Route2: 3V3 | 3V3 | 3V3 | 3V3
Route3: GND | GND | GND | GND
Route14: GND | GND | GND | GND
Route15: GND | GND | GND | GND
Bottom: GND | GND | GND | GND
tStop: mj838 - Čos / HW rev.1c
Reference: SW1 | CA | SW2 | CA | CB | CC | CB | CC | CD